# Altium schematic sheet P1.schdoc (part 1 of 3)
size 1187 x 840 mm; Symbol: Sheet-Symbol_A4; Company: EE_LAB; Version: V1.0; Page Size: A4; @Project Name: VIDEO_CONVERTER; @Page Count: 3; @Update Date: 2024-05-24; @Create Date: 2024-04-18; @Schematic Name: Schematic1; @Page No: 1; @Page Name: P1; Device: Sheet-Symbol_A4
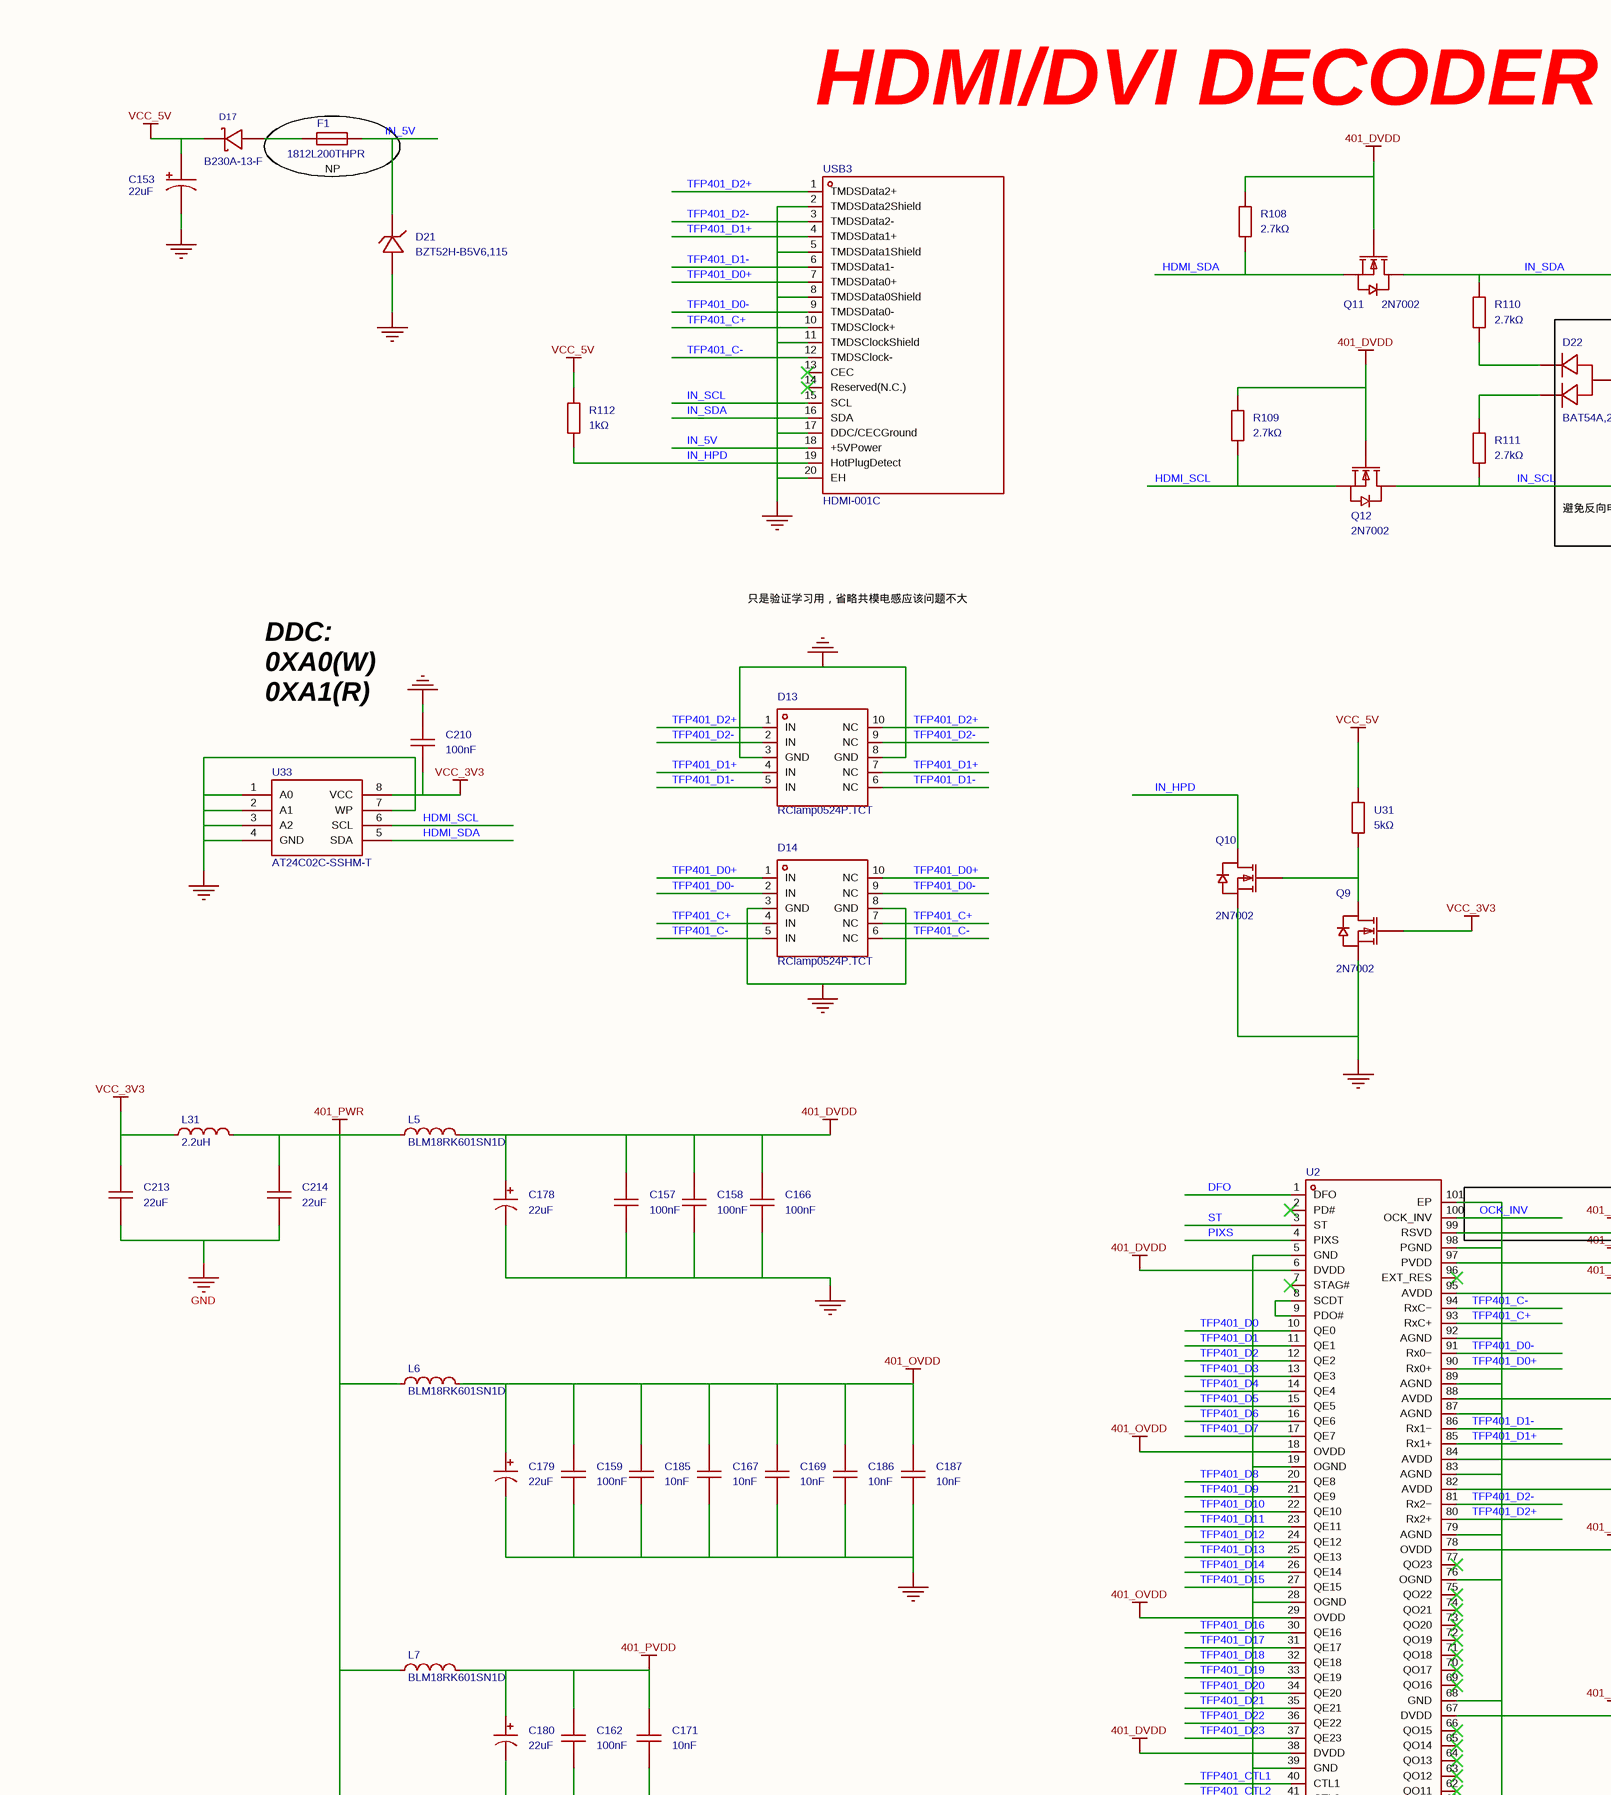
[diagram p0: P1.schdoc, top column 1 of 4]
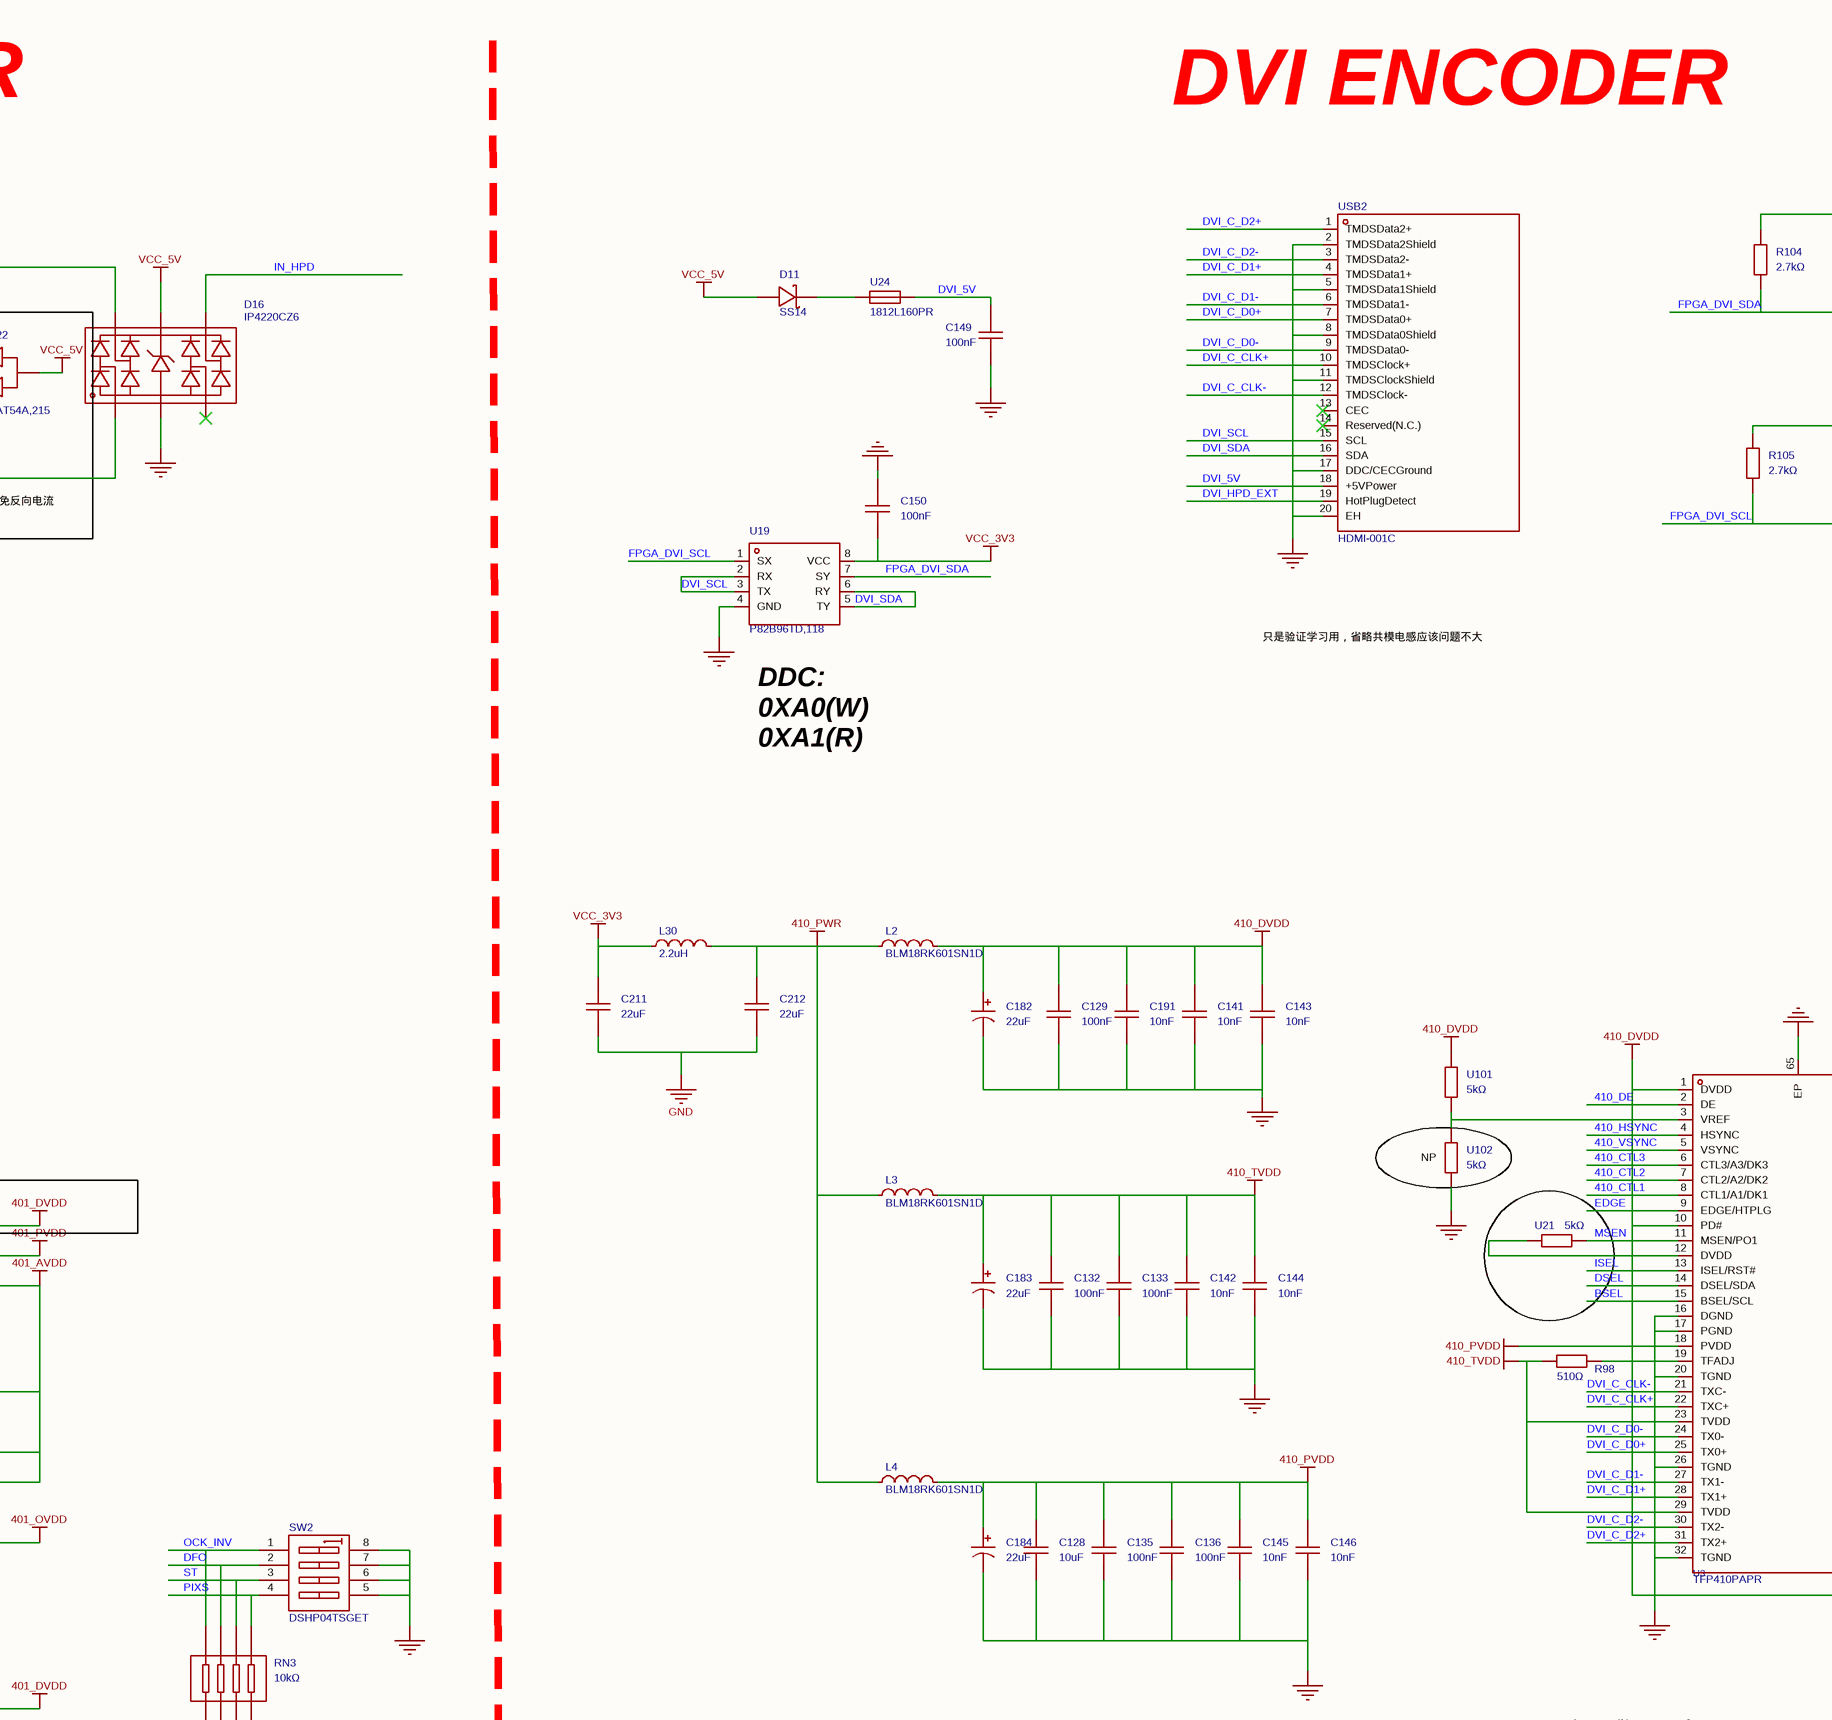
[diagram p1: P1.schdoc, top column 2 of 4]
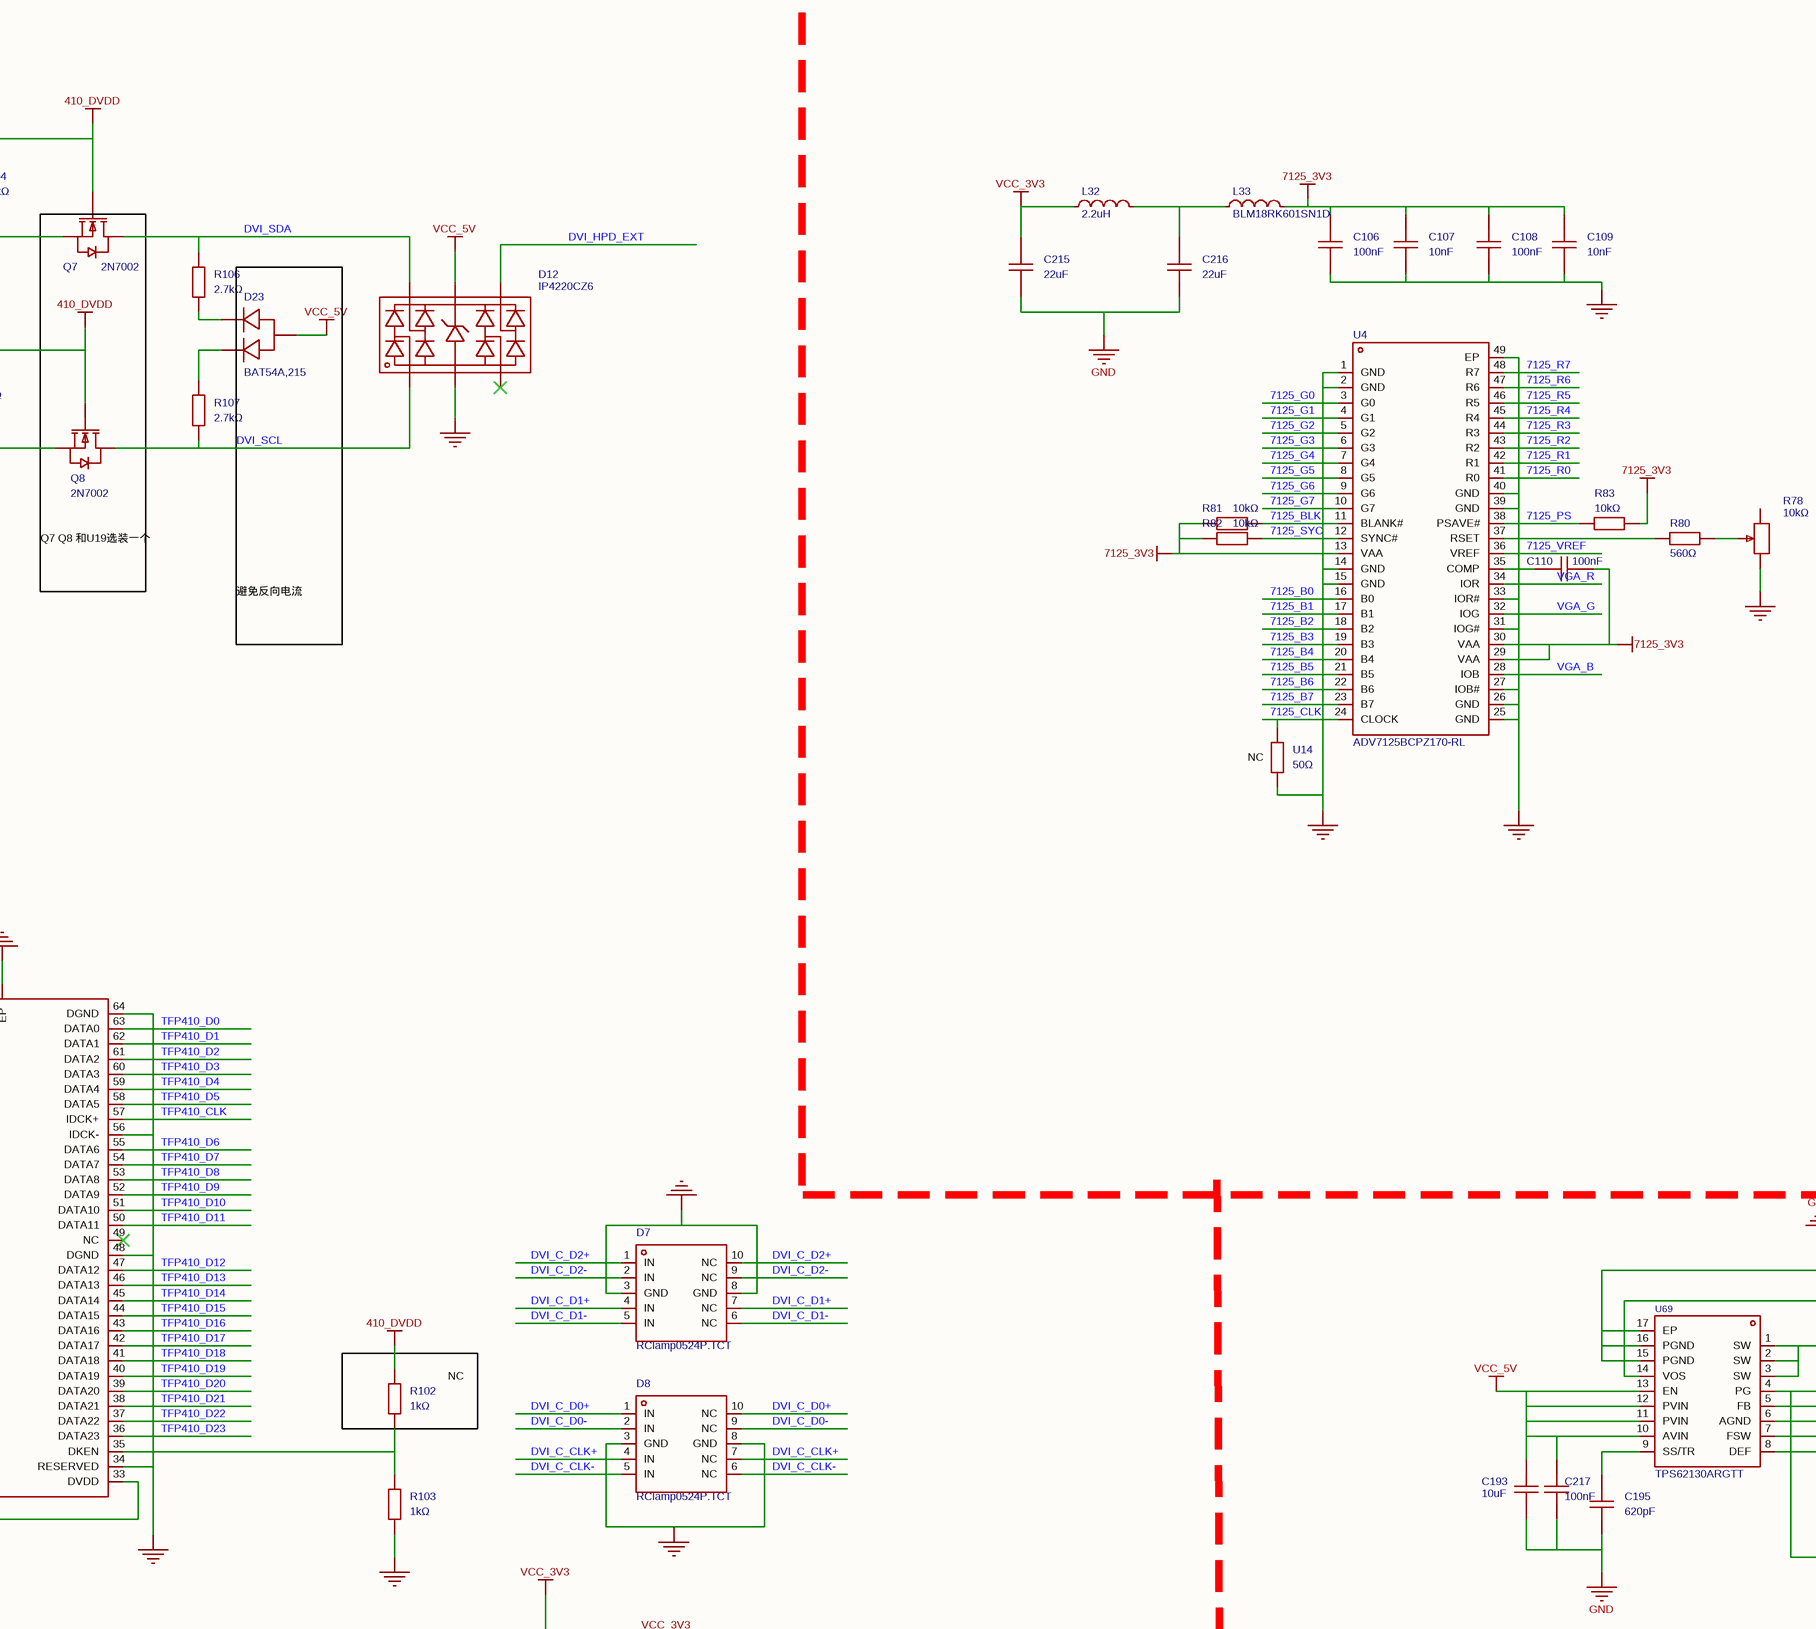
[diagram p2: P1.schdoc, top column 3 of 4]
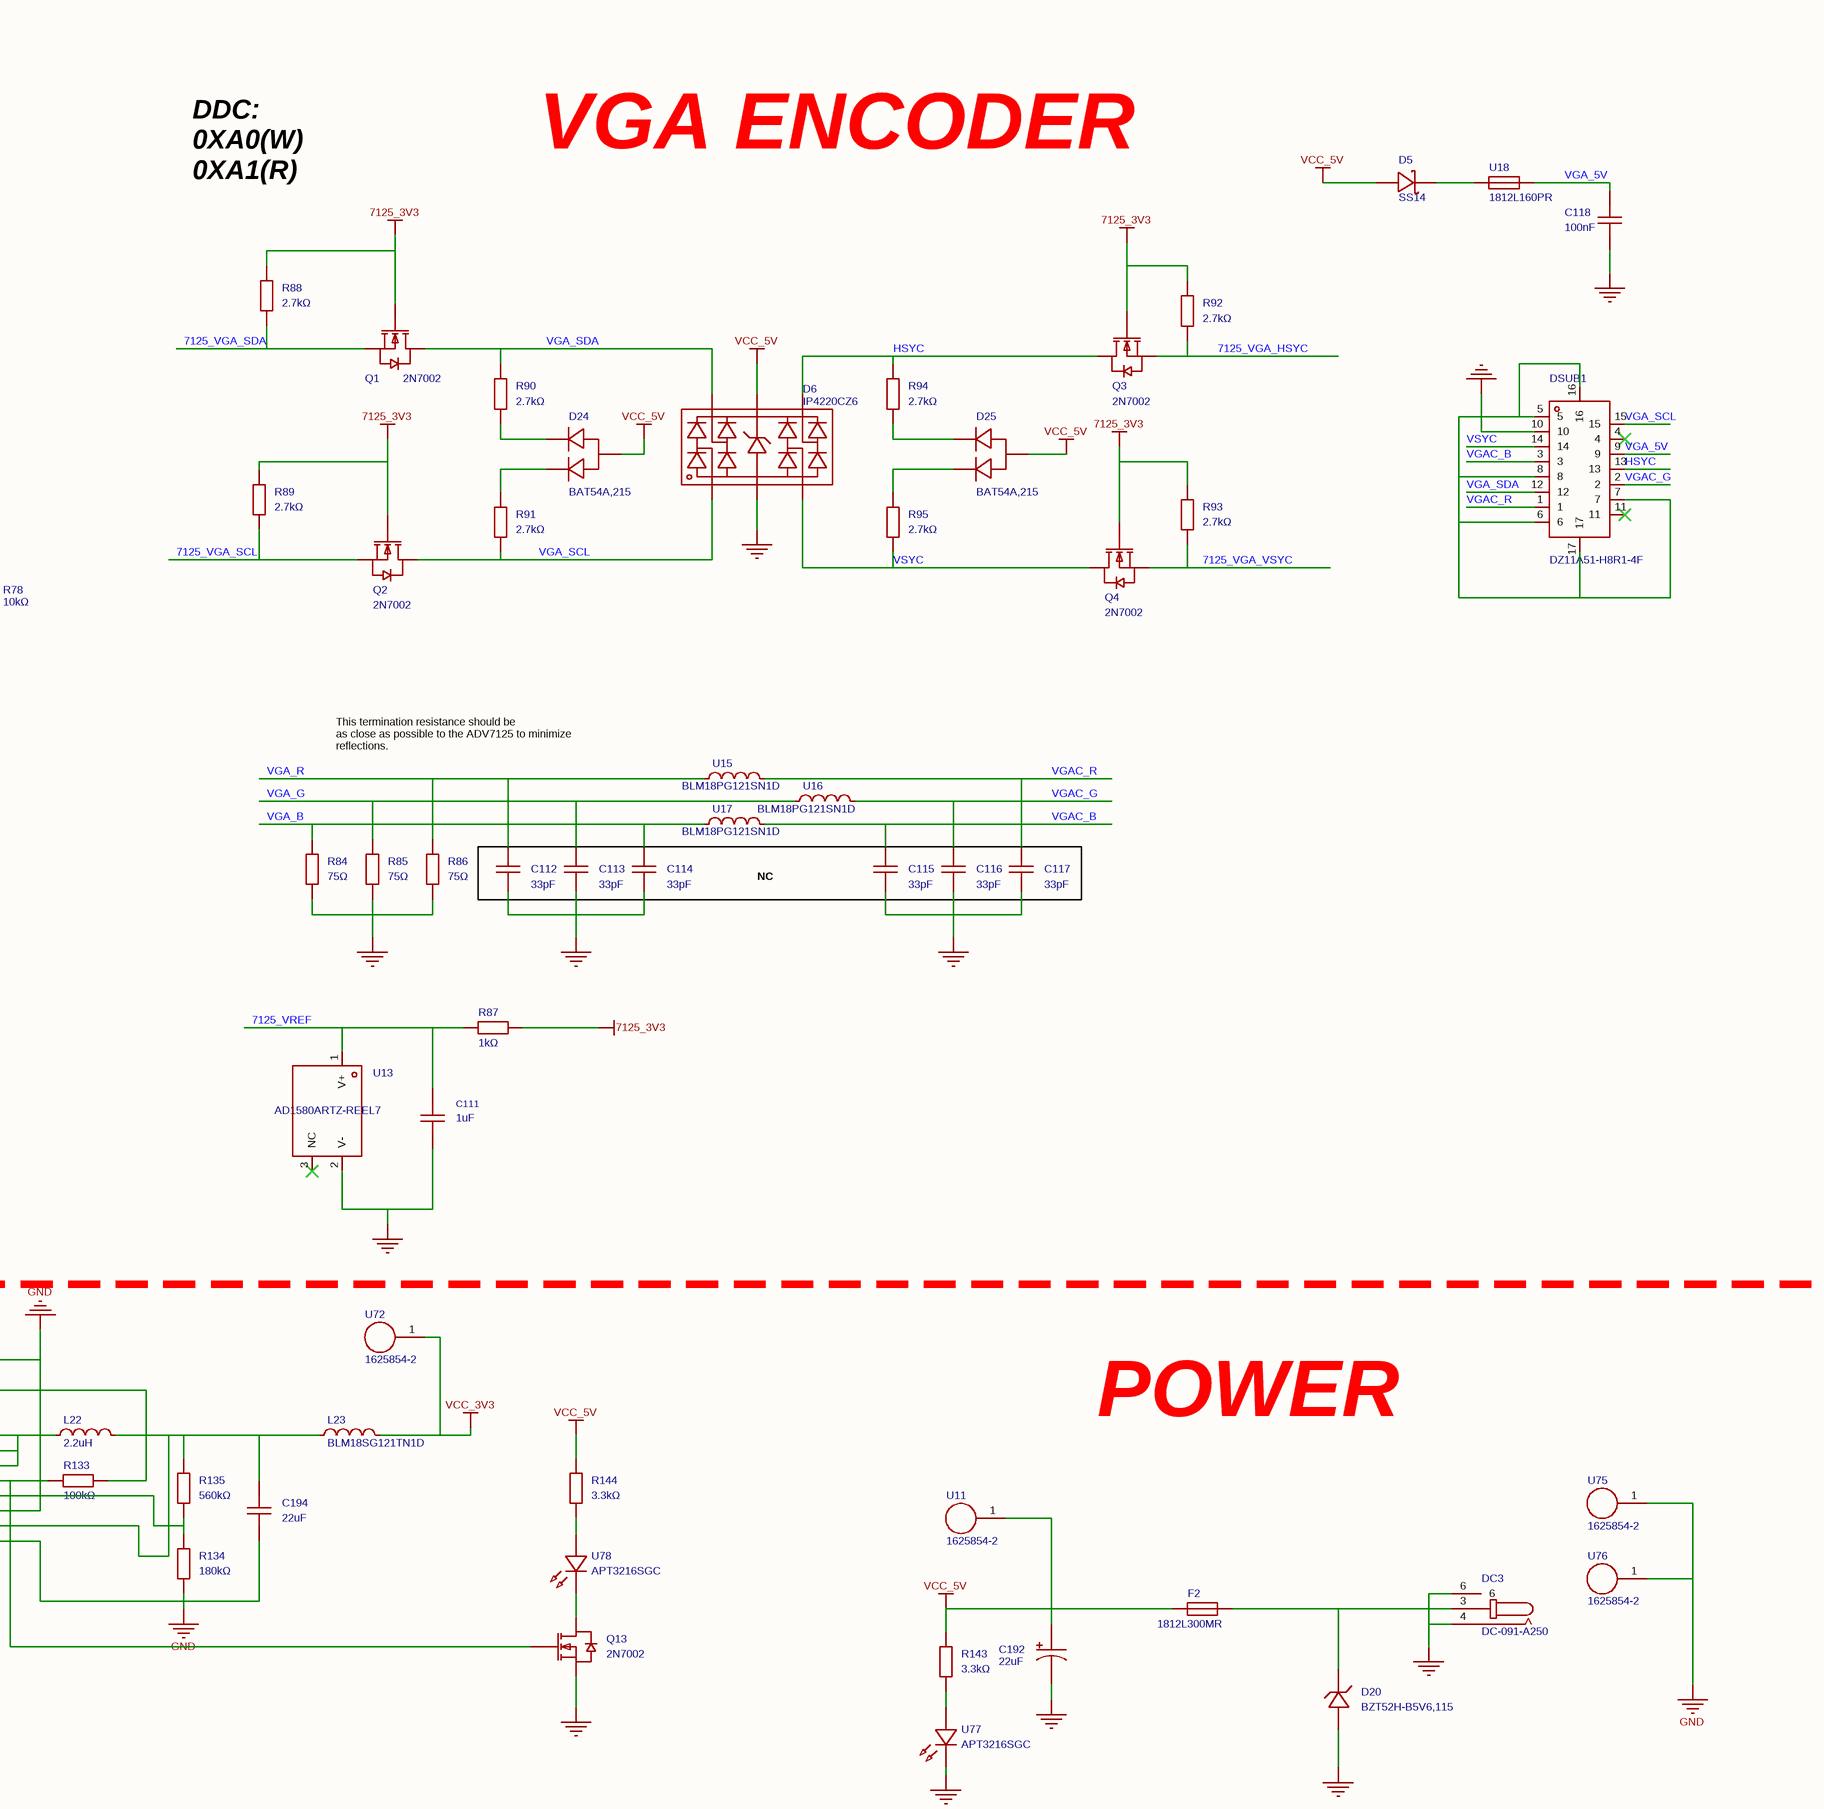
[diagram p3: P1.schdoc, top column 4 of 4]
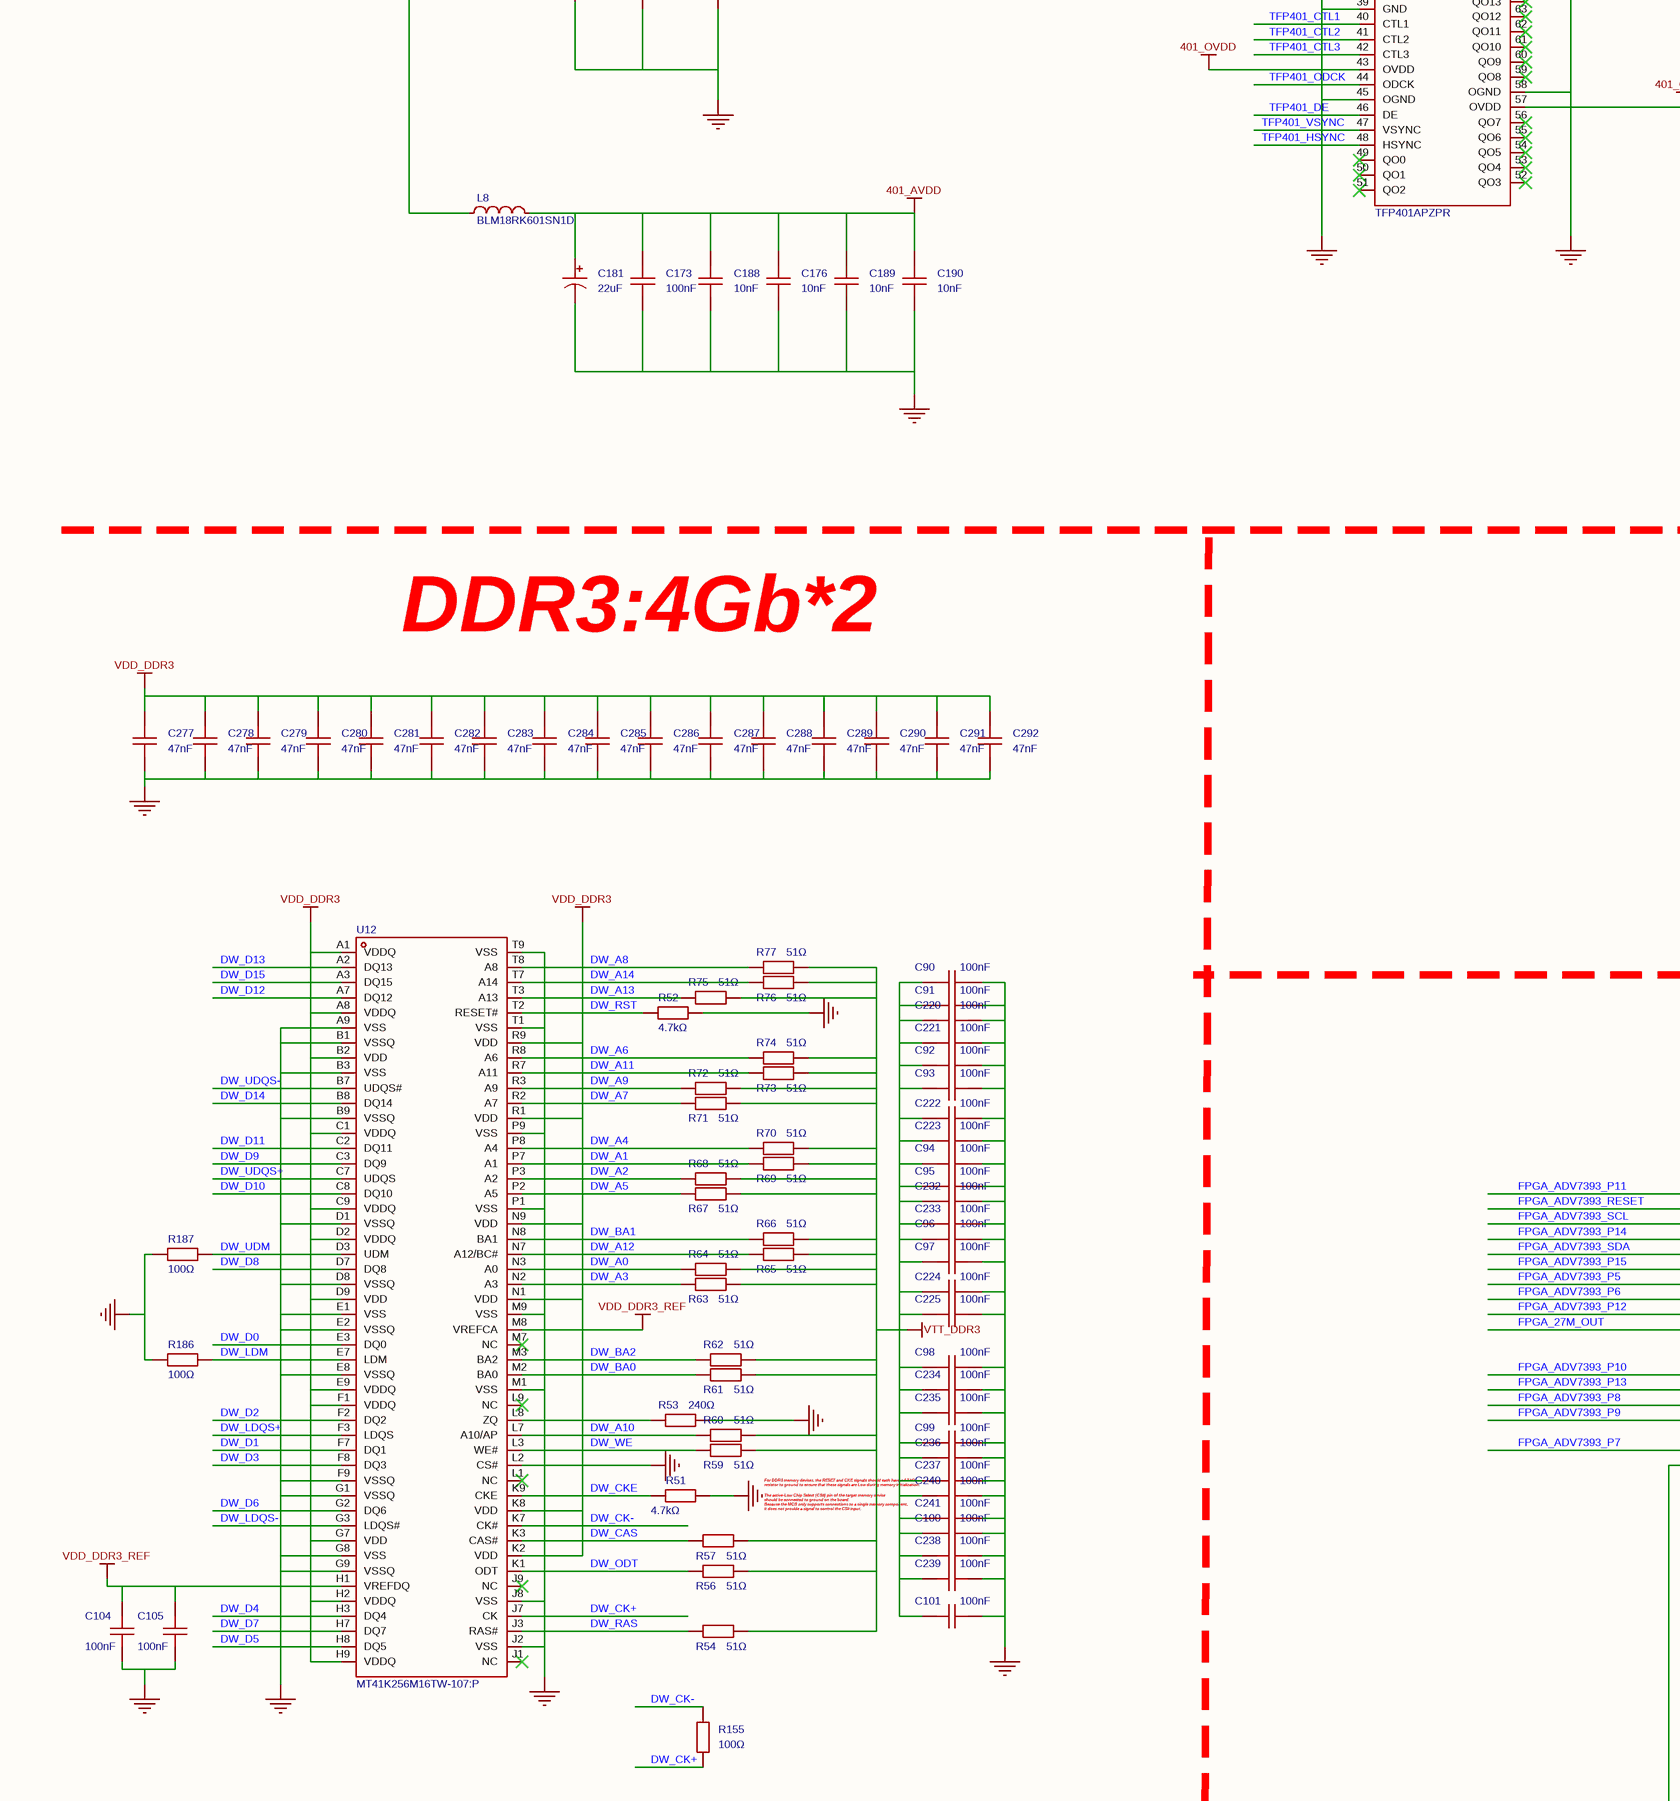
[diagram p4: P1.schdoc, centre column 1 of 4]
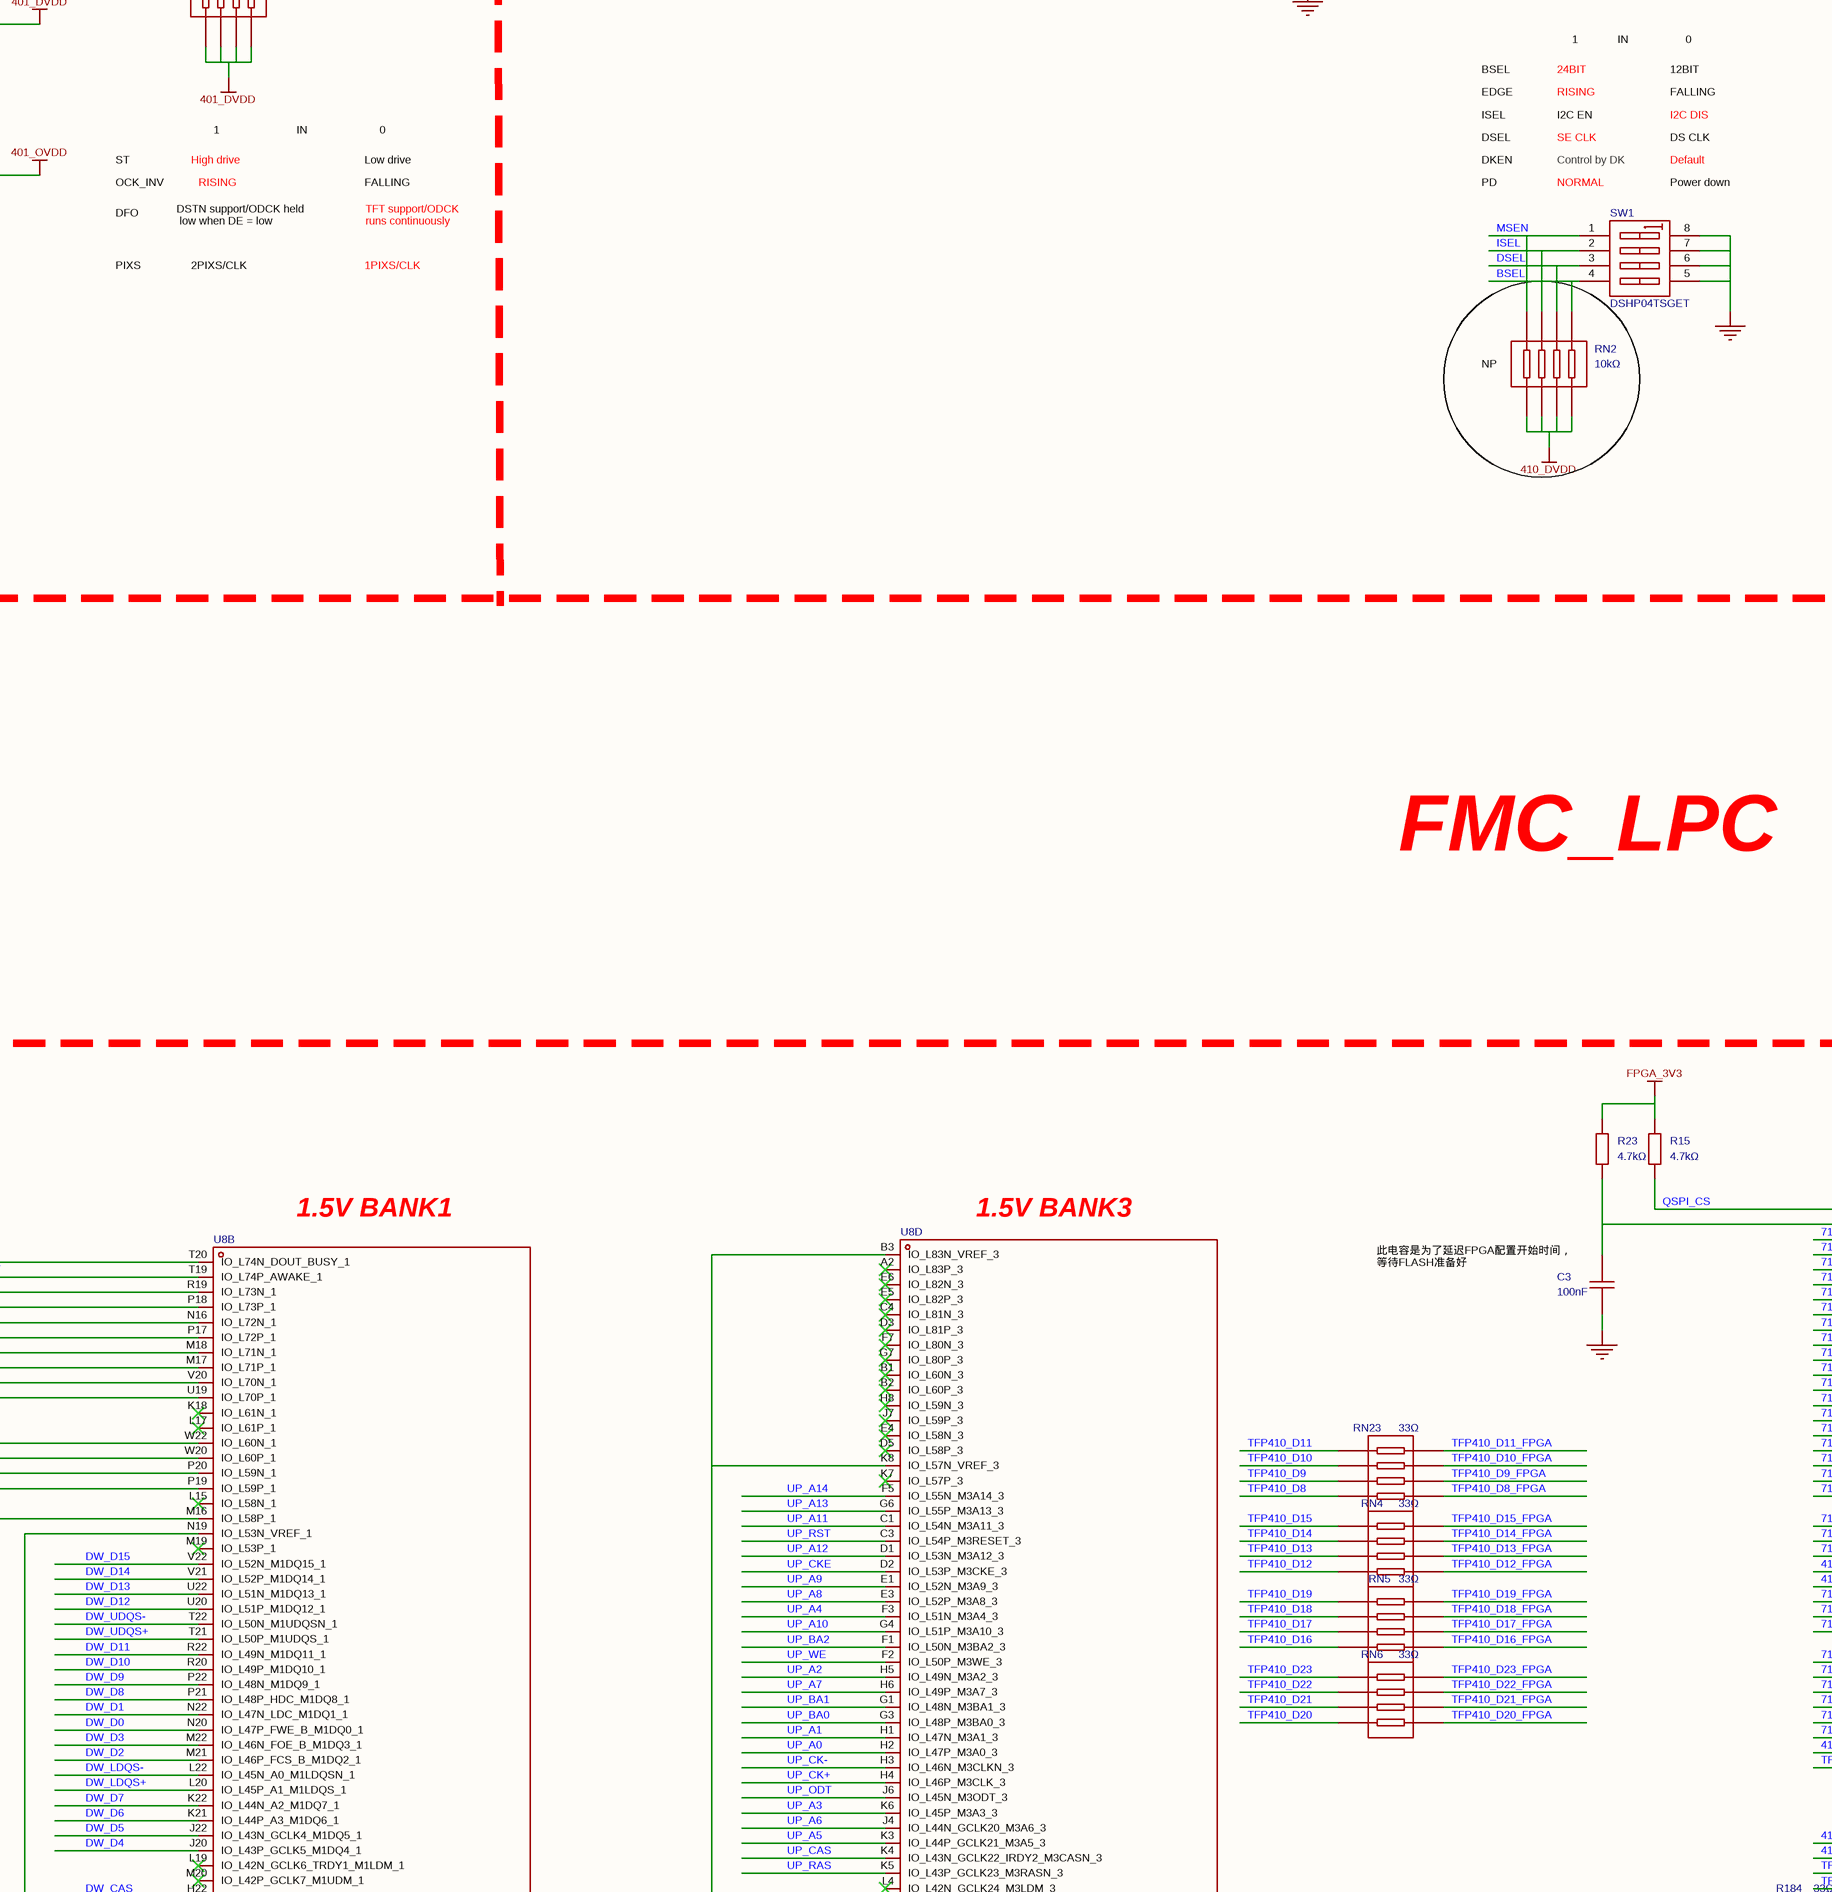
[diagram p5: P1.schdoc, centre column 2 of 4]
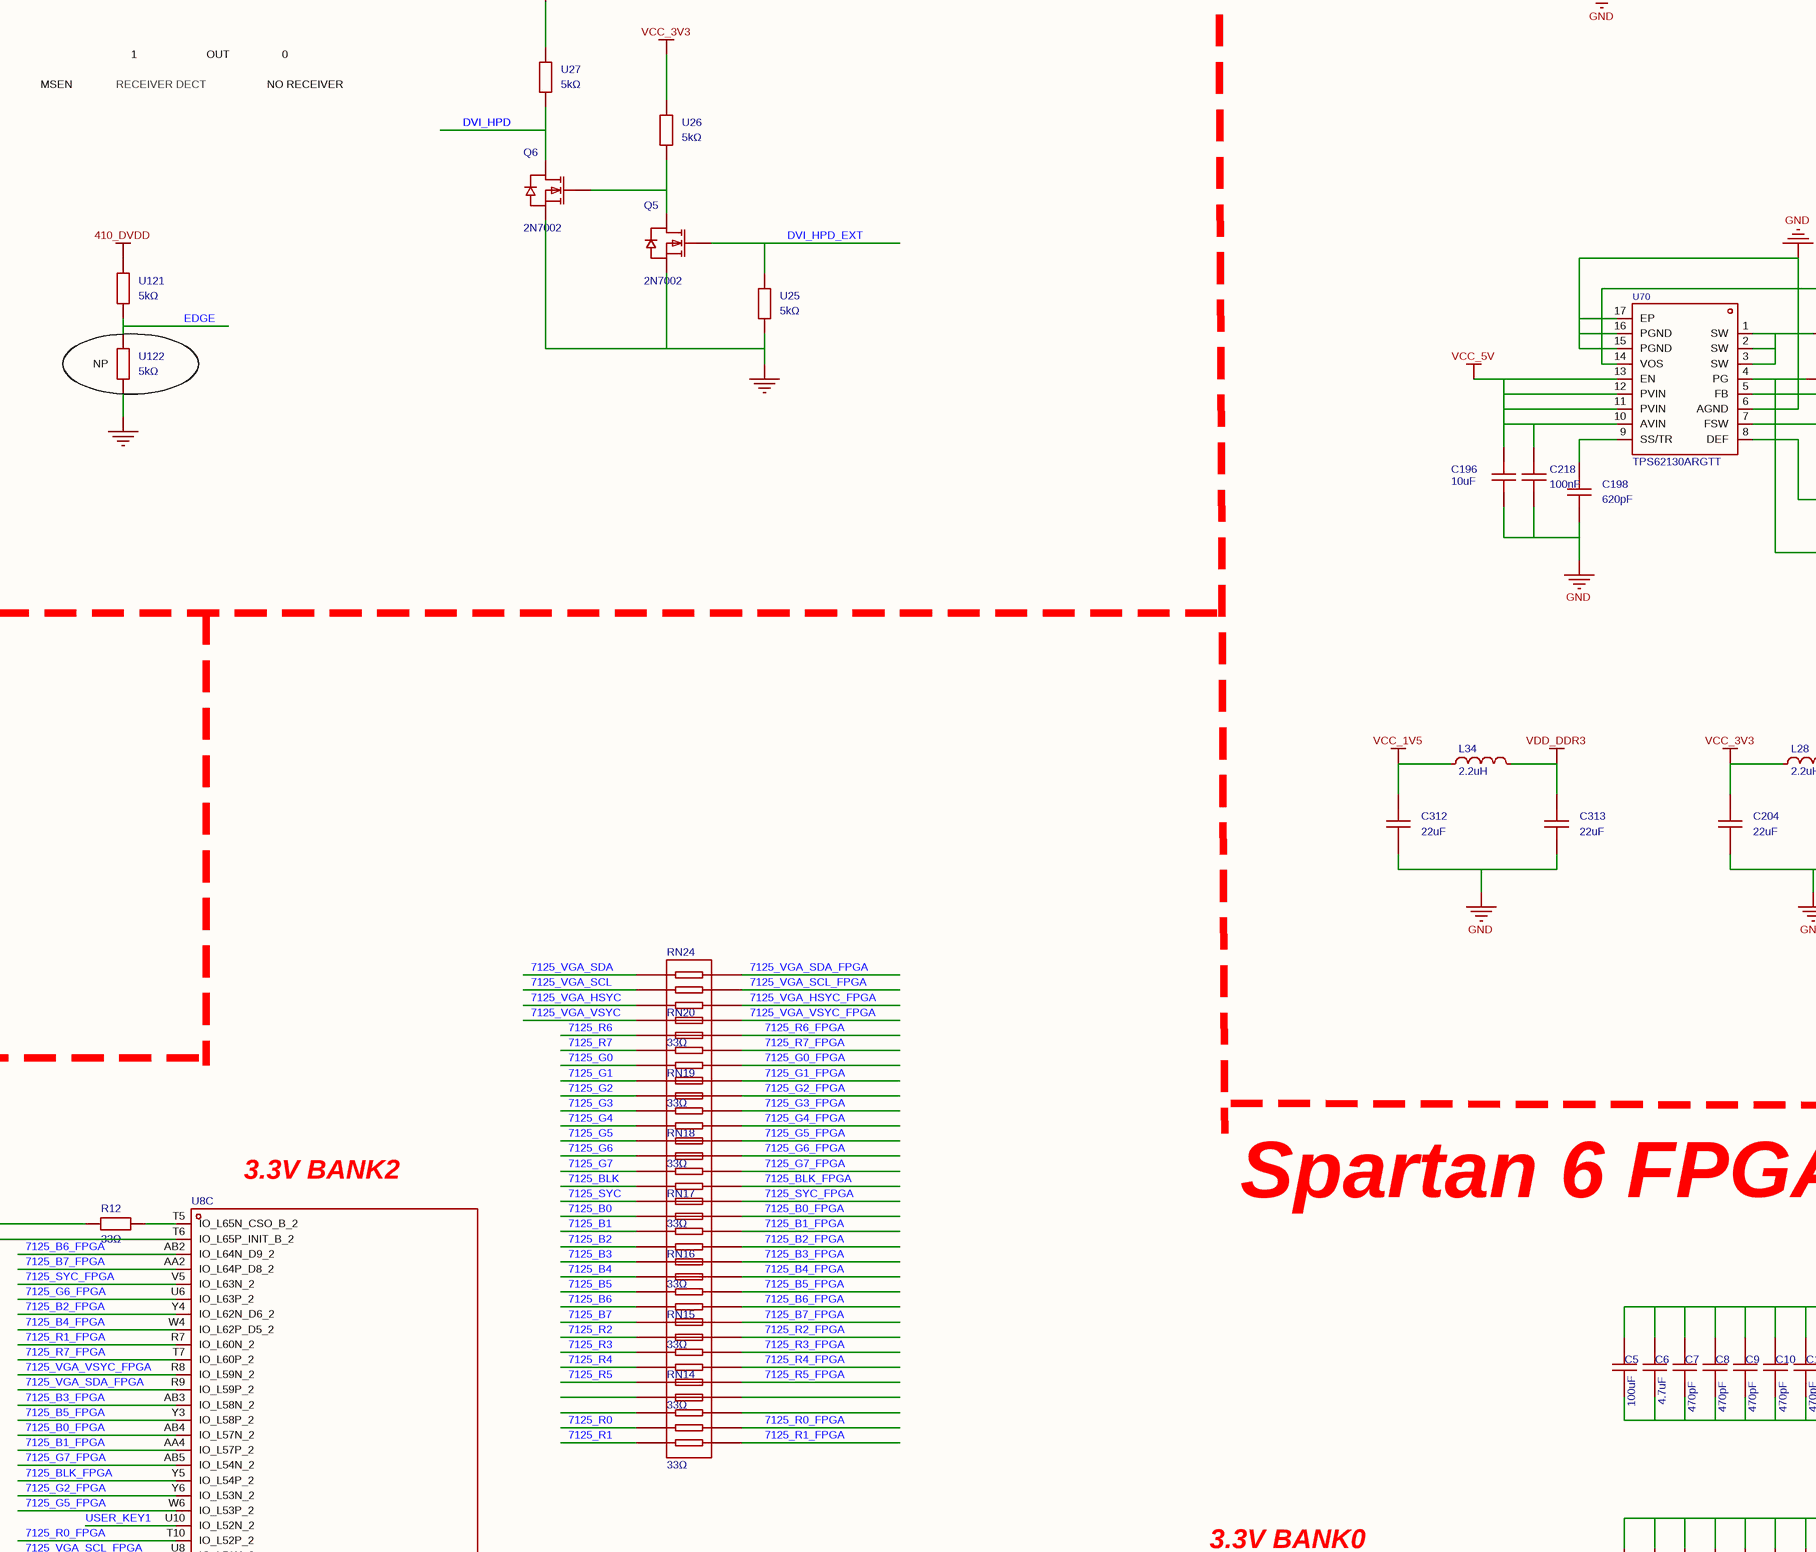
[diagram p6: P1.schdoc, centre column 3 of 4]
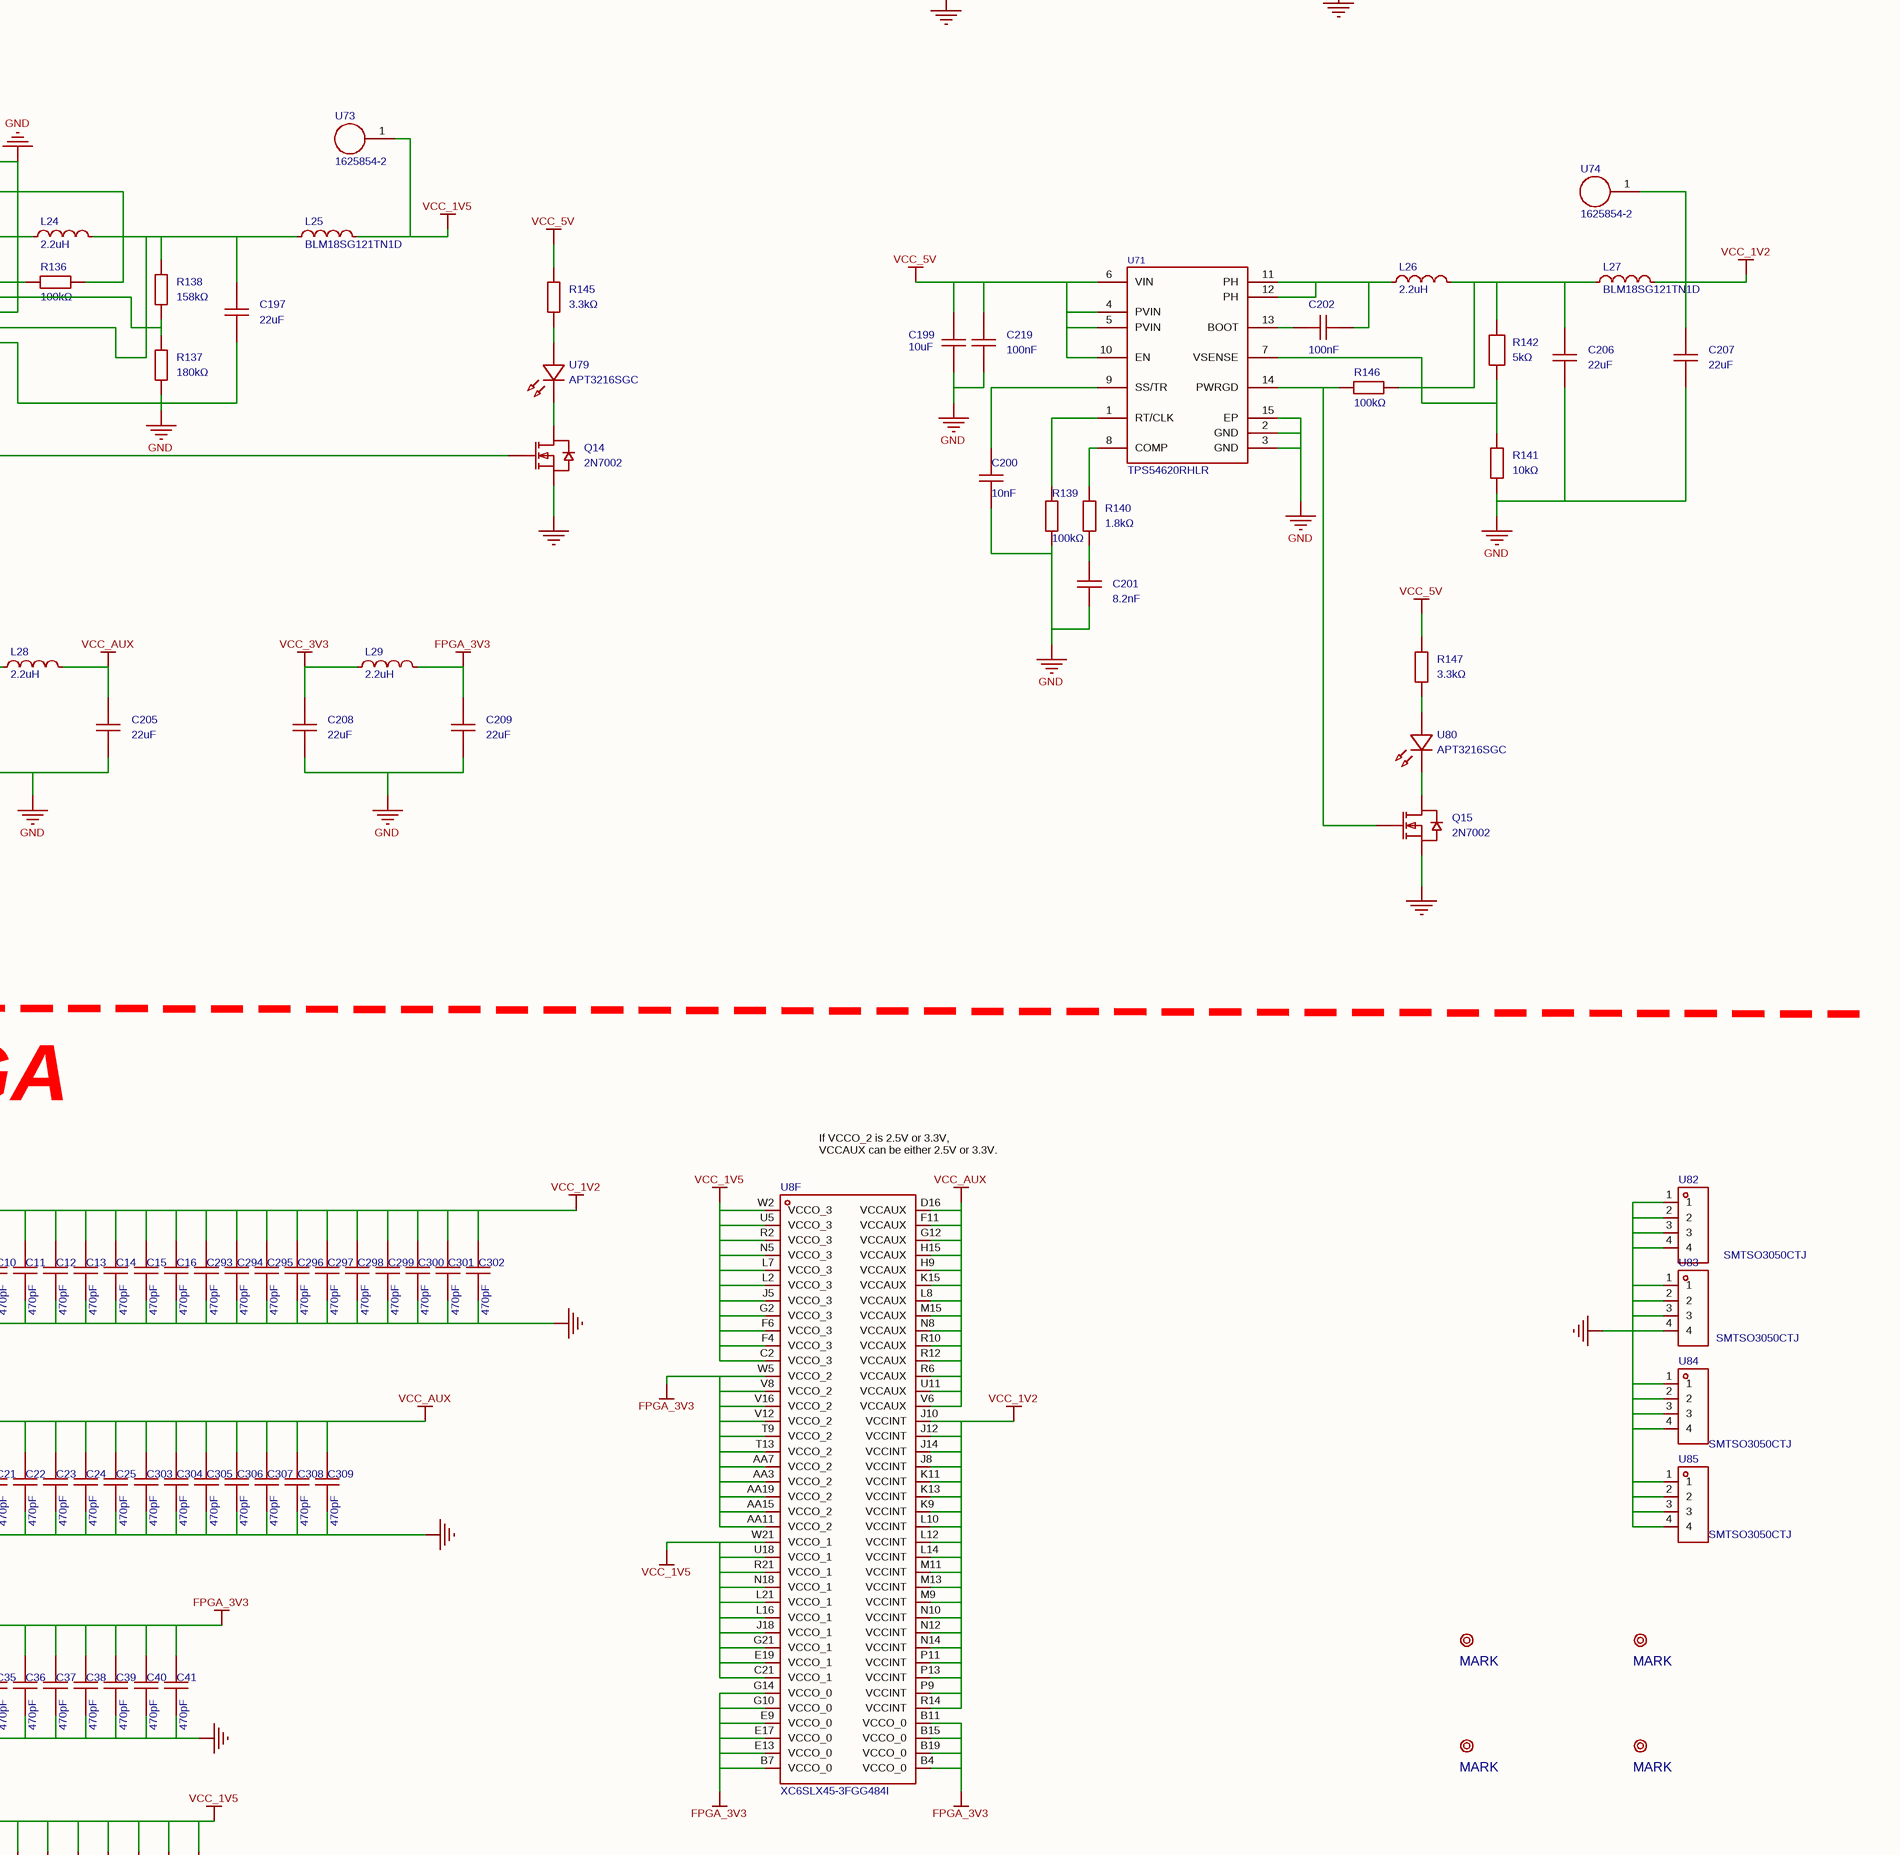
[diagram p7: P1.schdoc, centre column 4 of 4]
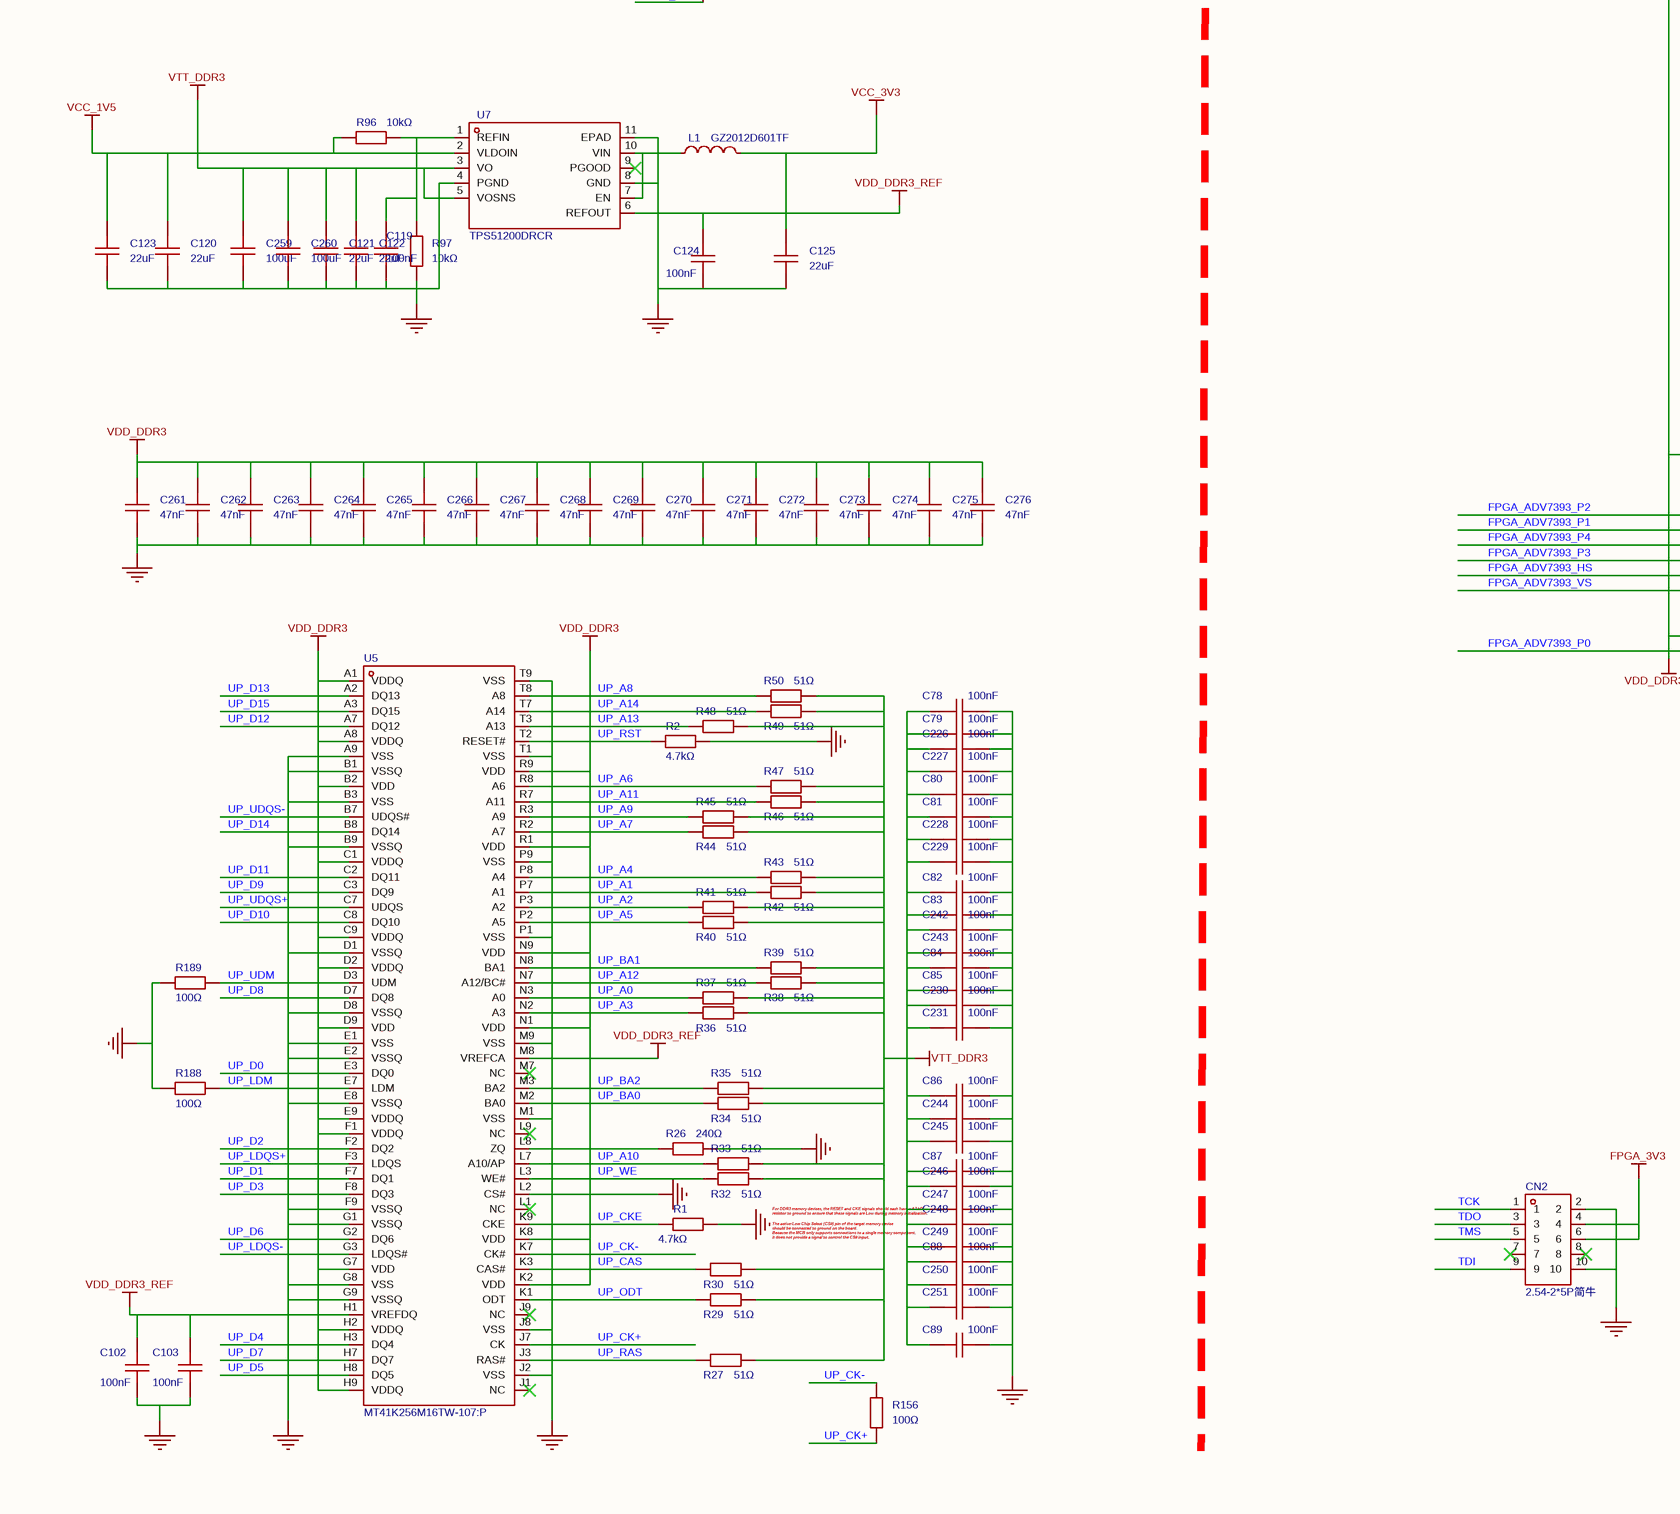
[diagram p8: P1.schdoc, bottom column 1 of 4]
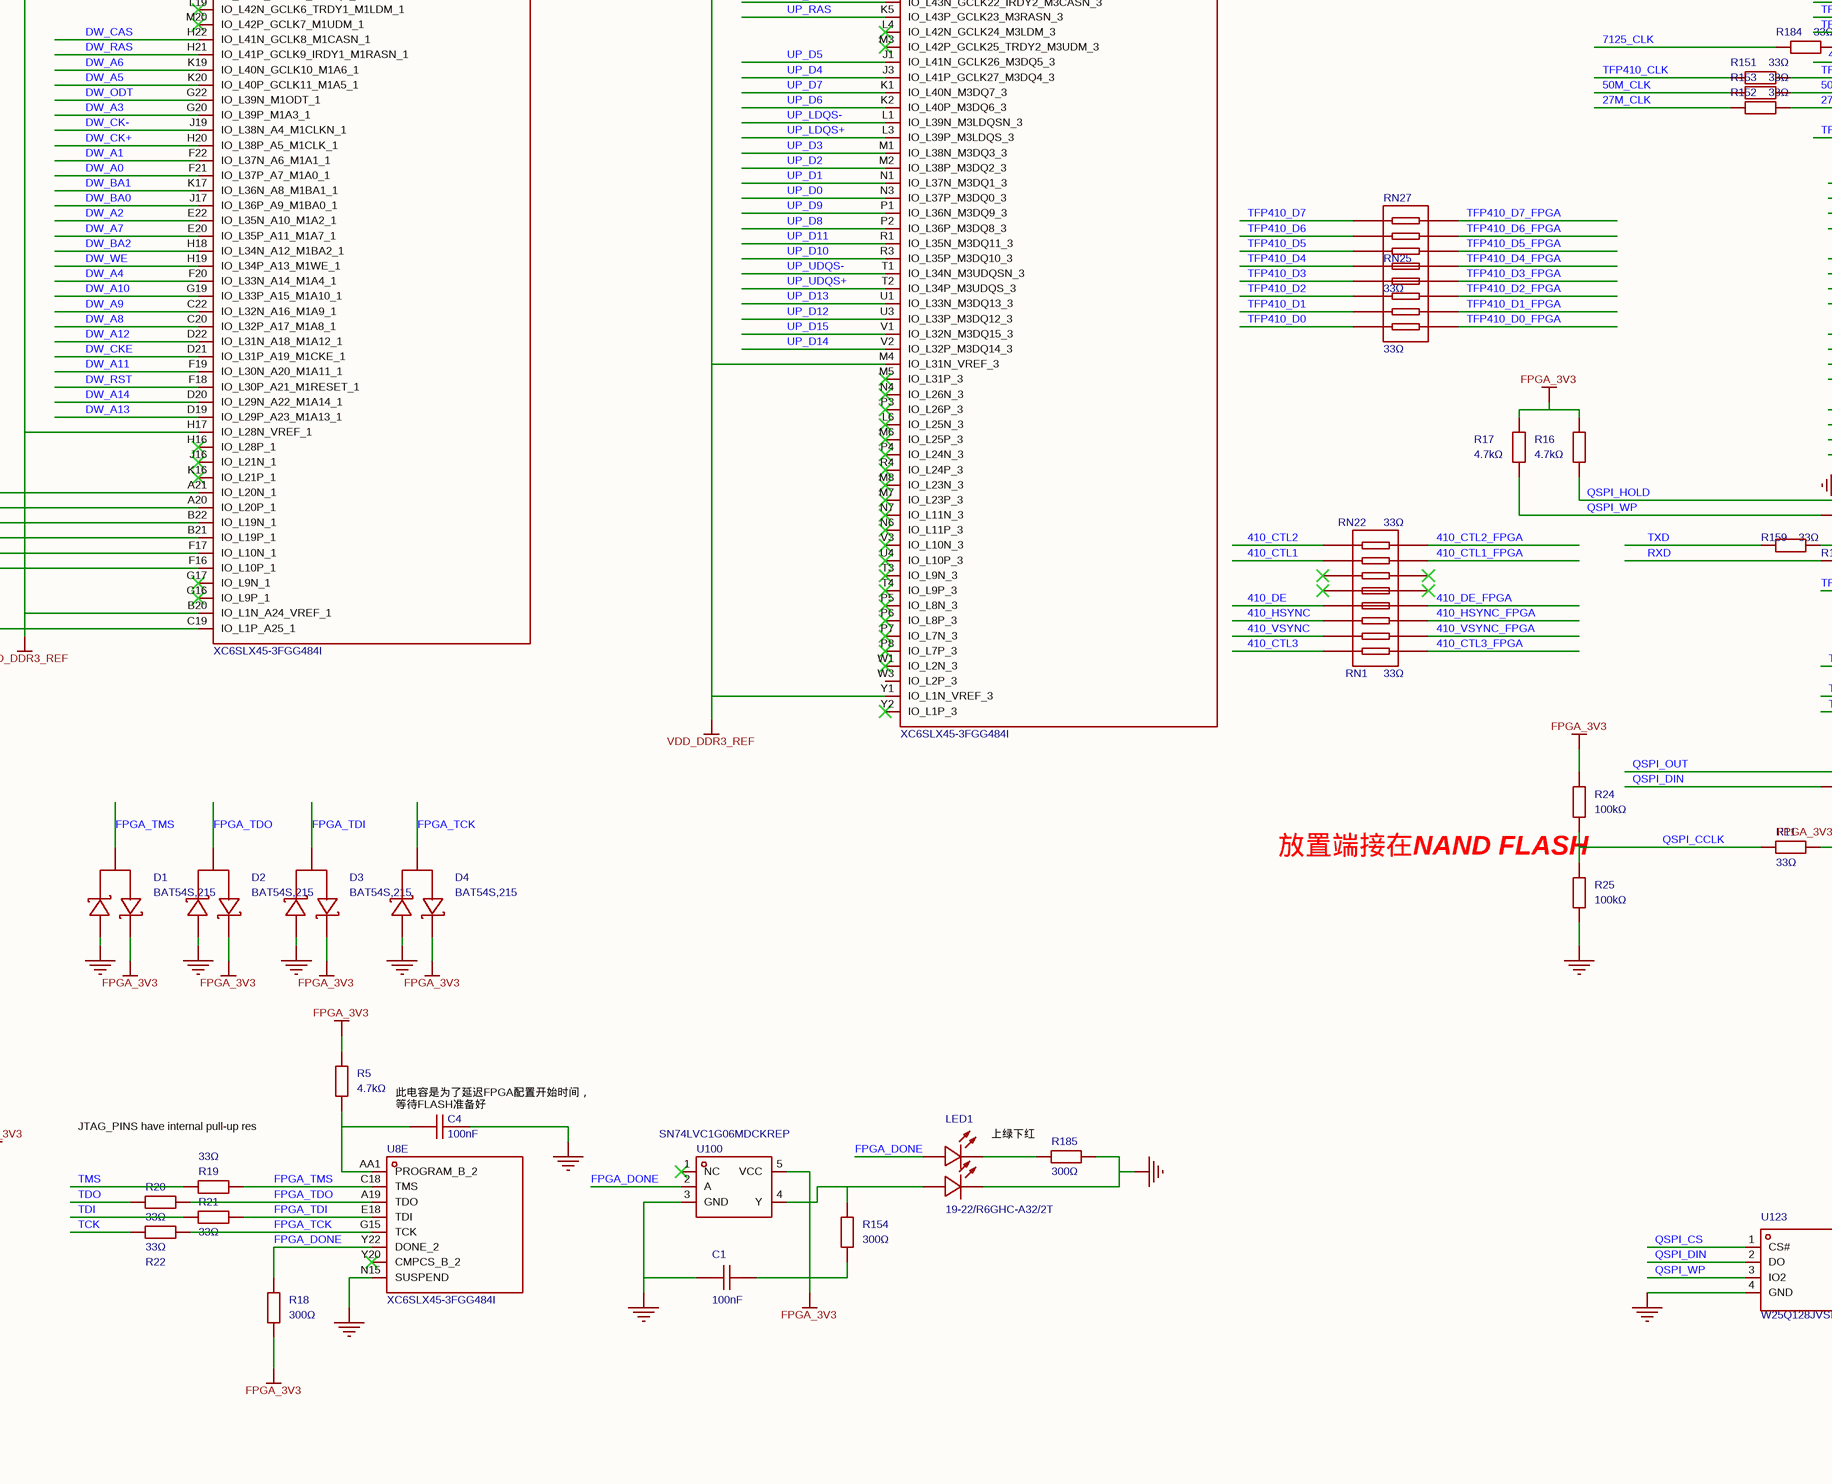
[diagram p9: P1.schdoc, bottom column 2 of 4]
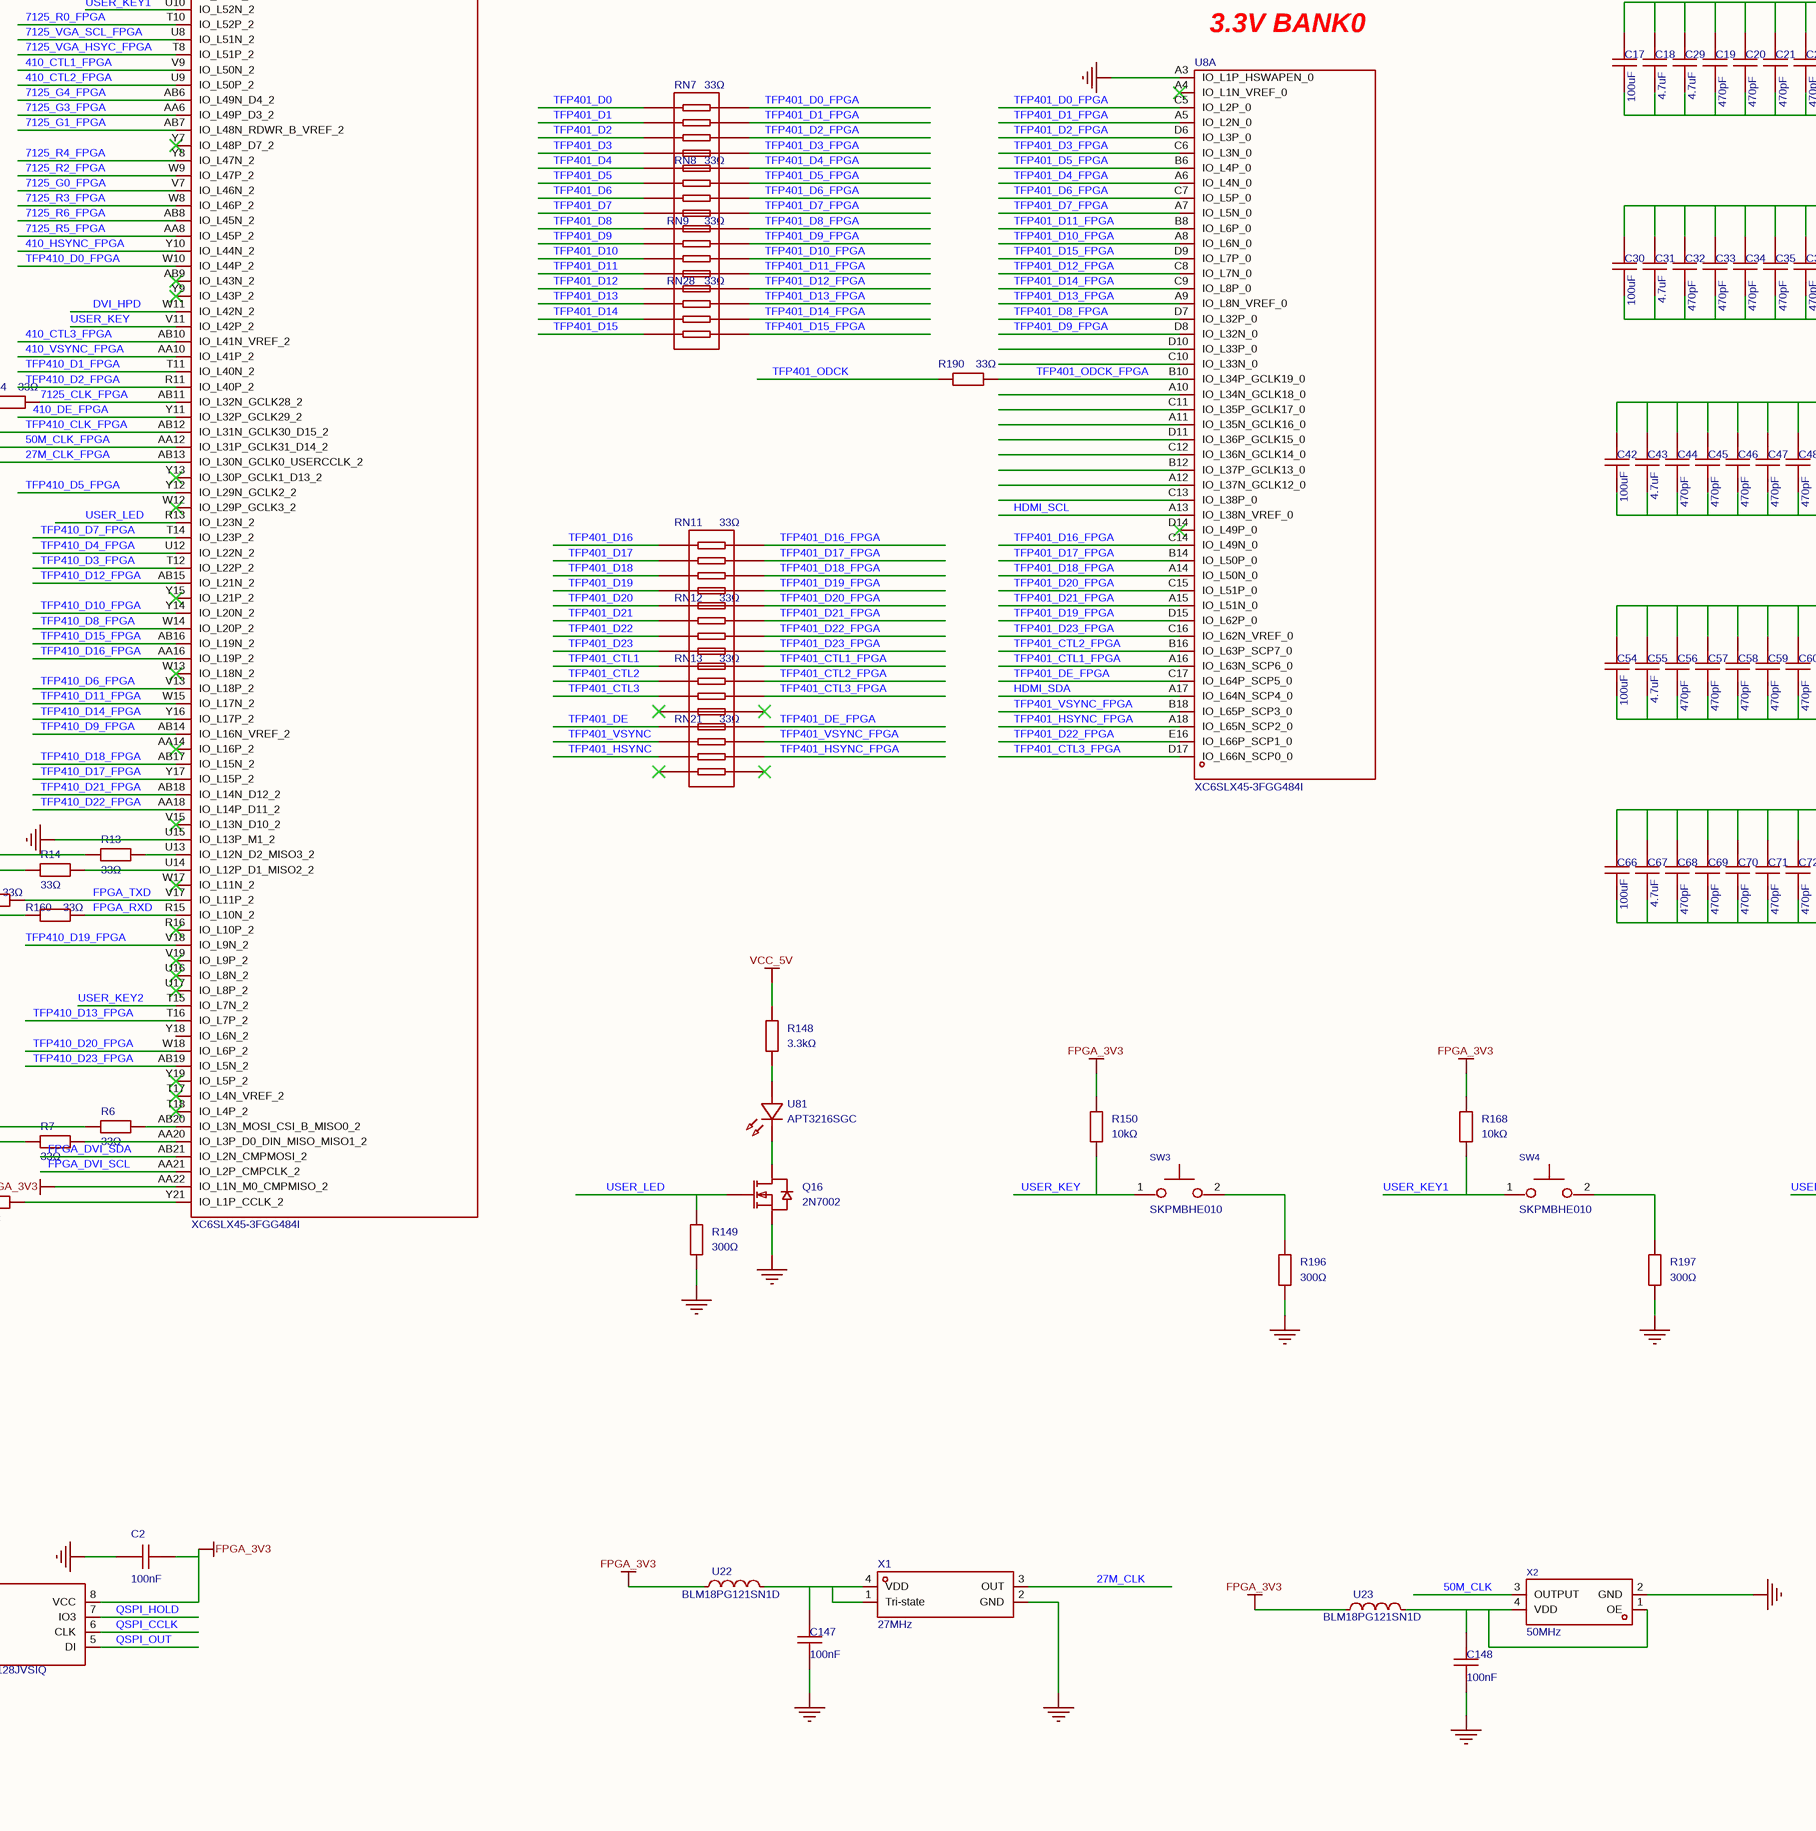
[diagram p10: P1.schdoc, bottom column 3 of 4]
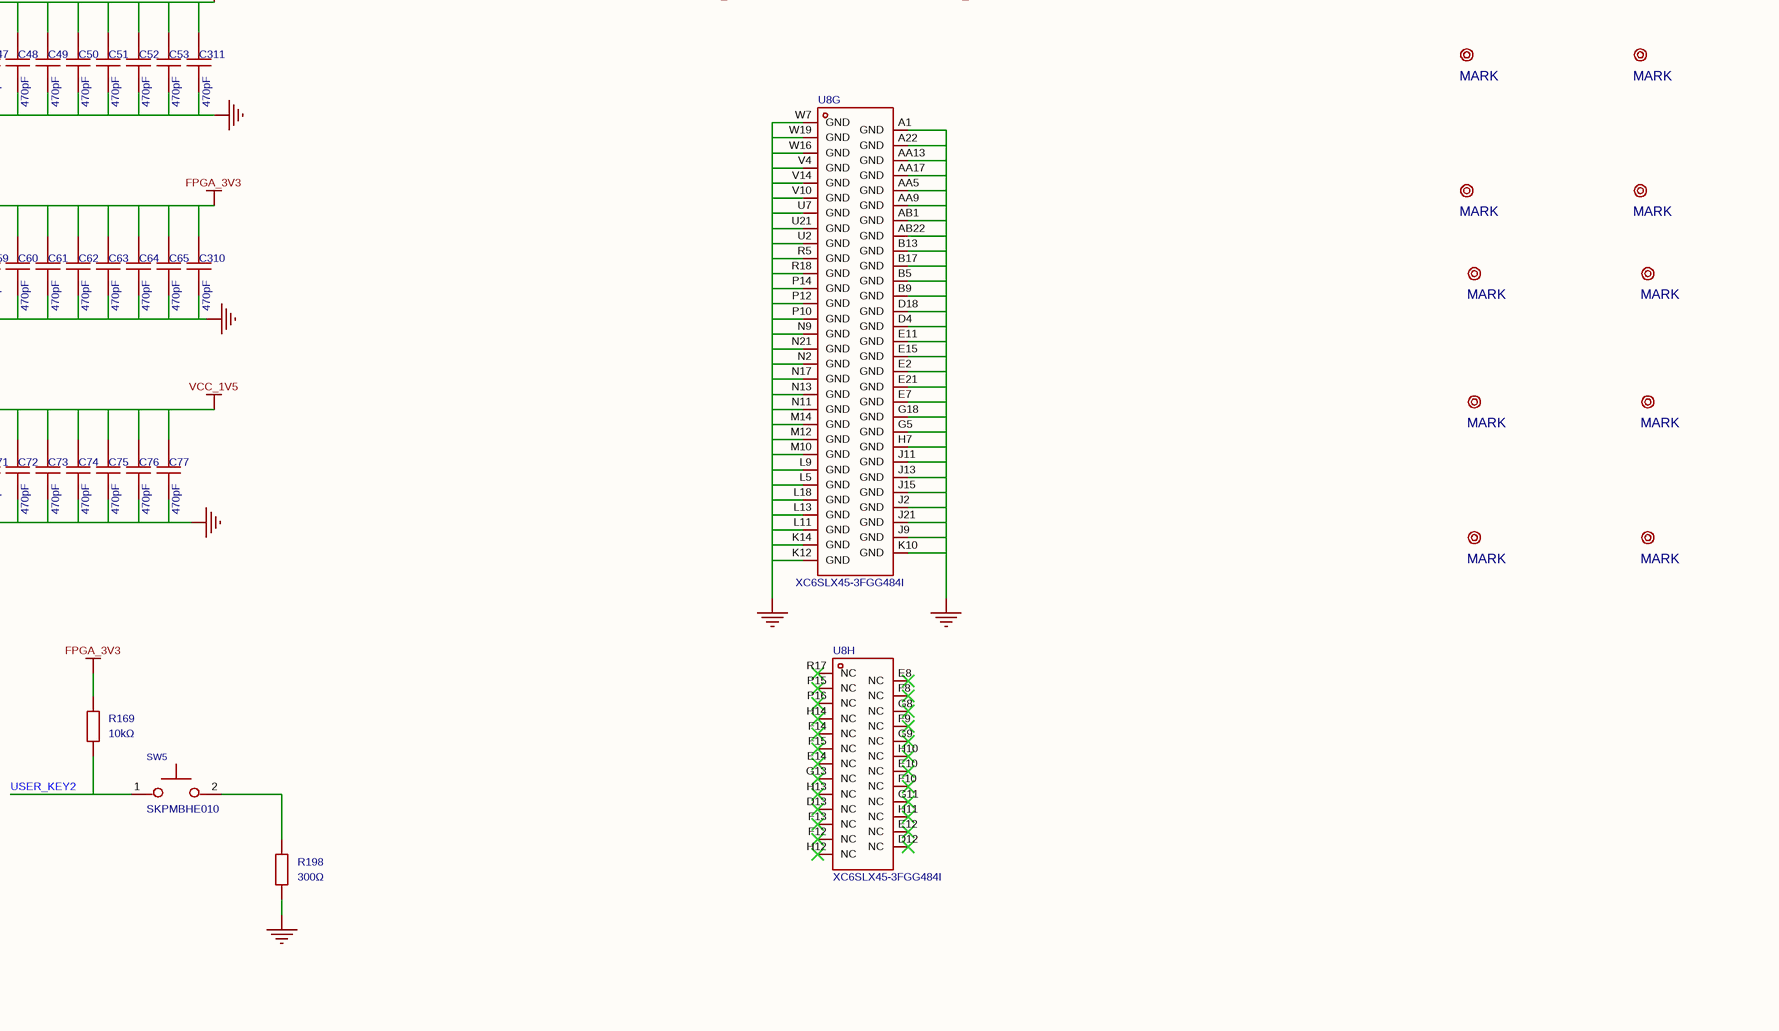
[diagram p11: P1.schdoc, bottom column 4 of 4]

## Parts
C1  100nF  [C0603]
C2  100nF  [C0603]
C3  100nF  [C0603]
C4  100nF  [C0603]
C5  100uF  [C1210]
C6  4.7uF  [C0603]
C7  470pF  [C0402]
C8  470pF  [C0402]
C9  470pF  [C0402]
C10  470pF  [C0402]
C11  470pF  [C0402]
C12  470pF  [C0402]
C13  470pF  [C0402]
C14  470pF  [C0402]
C15  470pF  [C0402]
C16  470pF  [C0402]
C17  100uF  [C1210]
C18  4.7uF  [C0603]
C19  470pF  [C0402]
C20  470pF  [C0402]
C21  470pF  [C0402]
C22  470pF  [C0402]
C23  470pF  [C0402]
C24  470pF  [C0402]
C25  470pF  [C0402]
C29  4.7uF  [C0603]
C30  100uF  [C1210]
C31  4.7uF  [C0603]
C32  470pF  [C0402]
C33  470pF  [C0402]
C34  470pF  [C0402]
C35  470pF  [C0402]
C36  470pF  [C0402]
C37  470pF  [C0402]
C38  470pF  [C0402]
C39  470pF  [C0402]
C40  470pF  [C0402]
C41  470pF  [C0402]
C42  100uF  [C1210]
C43  4.7uF  [C0603]
C44  470pF  [C0402]
C45  470pF  [C0402]
C46  470pF  [C0402]
C47  470pF  [C0402]
C48  470pF  [C0402]
C49  470pF  [C0402]
C50  470pF  [C0402]
C51  470pF  [C0402]
C52  470pF  [C0402]
C53  470pF  [C0402]
C54  100uF  [C1210]
C55  4.7uF  [C0603]
C56  470pF  [C0402]
C57  470pF  [C0402]
C58  470pF  [C0402]
C59  470pF  [C0402]
C60  470pF  [C0402]
C61  470pF  [C0402]
C62  470pF  [C0402]
C63  470pF  [C0402]
C64  470pF  [C0402]
C65  470pF  [C0402]
C66  100uF  [C1210]
C67  4.7uF  [C0603]
C68  470pF  [C0402]
C69  470pF  [C0402]
C70  470pF  [C0402]
C71  470pF  [C0402]
C72  470pF  [C0402]
C73  470pF  [C0402]
C74  470pF  [C0402]
C75  470pF  [C0402]
C76  470pF  [C0402]
C77  470pF  [C0402]
C78  100nF  [C0402]
C79  100nF  [C0402]
C80  100nF  [C0402]
C81  100nF  [C0402]
C82  100nF  [C0402]
C83  100nF  [C0402]
C84  100nF  [C0402]
C85  100nF  [C0402]
C86  100nF  [C0402]
C87  100nF  [C0402]
C88  100nF  [C0402]
C89  100nF  [C0402]
C90  100nF  [C0402]
C91  100nF  [C0402]
C92  100nF  [C0402]
C93  100nF  [C0402]
C94  100nF  [C0402]
C95  100nF  [C0402]
C96  100nF  [C0402]
C97  100nF  [C0402]
C98  100nF  [C0402]
C99  100nF  [C0402]
C100  100nF  [C0402]
C101  100nF  [C0402]
C102  100nF  [C0402]
C103  100nF  [C0402]
C104  100nF  [C0402]
C105  100nF  [C0402]
C106  100nF  [C0402]
C107  10nF  [C0402]
C108  100nF  [C0402]
C109  10nF  [C0402]
C110  100nF  [C0402]
C111  1uF  [C0402]
C112  33pF  [C0402]
C113  33pF  [C0402]
C114  33pF  [C0402]
C115  33pF  [C0402]
C116  33pF  [C0402]
C117  33pF  [C0402]
C118  100nF  [C0603]
C119  100nF  [C0402]
C120  22uF  [C0402]
C121  22uF  [C0402]
C122  22uF  [C0402]
C123  22uF  [C0402]
C124  100nF  [C0402]
C125  22uF  [C0402]
C128  10uF  [C0805]
C129  100nF  [C0402]
C132  100nF  [C0402]
C133  100nF  [C0402]
C135  100nF  [C0402]
C136  100nF  [C0402]
C141  10nF  [C0402]
C142  10nF  [C0402]
C143  10nF  [C0402]
C144  10nF  [C0402]
C145  10nF  [C0402]
C146  10nF  [C0402]
C147  100nF  [C0603]
C148  100nF  [C0603]
C149  100nF  [C0603]
C150  100nF  [C0402]
C153  22uF  [CAP-SMD_BD5.0-L5.3-W5.3-FD]
C157  100nF  [C0402]
C158  100nF  [C0402]
C159  100nF  [C0402]
C162  100nF  [C0402]
C166  100nF  [C0402]
C167  10nF  [C0402]
C169  10nF  [C0402]
C171  10nF  [C0402]
C173  100nF  [C0402]
C176  10nF  [C0402]
C178  22uF  [CAP-SMD_L3.5-W2.8-R-RD]
C179  22uF  [CAP-SMD_L3.5-W2.8-R-RD]
C180  22uF  [CAP-SMD_L3.5-W2.8-R-RD]
C181  22uF  [CAP-SMD_L3.5-W2.8-R-RD]
C182  22uF  [CAP-SMD_L3.5-W2.8-R-RD]
C183  22uF  [CAP-SMD_L3.5-W2.8-R-RD]
C184  22uF  [CAP-SMD_L3.5-W2.8-R-RD]
C185  10nF  [C0402]
C186  10nF  [C0402]
C187  10nF  [C0402]
C188  10nF  [C0402]
C189  10nF  [C0402]
C190  10nF  [C0402]
C191  10nF  [C0402]
C192  22uF  [CAP-SMD_BD5.0-L5.3-W5.3-FD]
C193  10uF  [C0805]
C194  22uF  [C0805]
C195  620pF  [C0603]
C196  10uF  [C0805]
C197  22uF  [C0805]
C198  620pF  [C0603]
C199  10uF  [C0805]
C200  10nF  [C0402]
C201  8.2nF  [C0402]
C202  100nF  [C0603]
C204  22uF  [C1210]
C205  22uF  [C1210]
C206  22uF  [C1210]
C207  22uF  [C1210]
C208  22uF  [C1210]
C209  22uF  [C1210]
C210  100nF  [C0402]
C211  22uF  [C1210]
C212  22uF  [C1210]
C213  22uF  [C1210]
C214  22uF  [C1210]
C215  22uF  [C1210]
C216  22uF  [C1210]
C217  100nF  [C0402]
C218  100nF  [C0402]
C219  100nF  [C0402]
C220  100nF  [C0402]
C221  100nF  [C0402]
C222  100nF  [C0402]
C223  100nF  [C0402]
C224  100nF  [C0402]
C225  100nF  [C0402]
C226  100nF  [C0402]
C227  100nF  [C0402]
C228  100nF  [C0402]
C229  100nF  [C0402]
C230  100nF  [C0402]
C231  100nF  [C0402]
C232  100nF  [C0402]
C233  100nF  [C0402]
C234  100nF  [C0402]
C235  100nF  [C0402]
C236  100nF  [C0402]
C237  100nF  [C0402]
C238  100nF  [C0402]
C239  100nF  [C0402]
C240  100nF  [C0402]
C241  100nF  [C0402]
C242  100nF  [C0402]
C243  100nF  [C0402]
C244  100nF  [C0402]
C245  100nF  [C0402]
C246  100nF  [C0402]
C247  100nF  [C0402]
C248  100nF  [C0402]
C249  100nF  [C0402]
C250  100nF  [C0402]
C251  100nF  [C0402]
C259  100uF  [C1206]
C260  100uF  [C1206]
C261  47nF  [C0402]
C262  47nF  [C0402]
C263  47nF  [C0402]
C264  47nF  [C0402]
C265  47nF  [C0402]
C266  47nF  [C0402]
C267  47nF  [C0402]
C268  47nF  [C0402]
C269  47nF  [C0402]
C270  47nF  [C0402]
C271  47nF  [C0402]
C272  47nF  [C0402]
C273  47nF  [C0402]
C274  47nF  [C0402]
C275  47nF  [C0402]
C276  47nF  [C0402]
C277  47nF  [C0402]
C278  47nF  [C0402]
C279  47nF  [C0402]
C280  47nF  [C0402]
C281  47nF  [C0402]
C282  47nF  [C0402]
C283  47nF  [C0402]
C284  47nF  [C0402]
C285  47nF  [C0402]
C286  47nF  [C0402]
C287  47nF  [C0402]
C288  47nF  [C0402]
C289  47nF  [C0402]
C290  47nF  [C0402]
C291  47nF  [C0402]
C292  47nF  [C0402]
C293  470pF  [C0402]
C294  470pF  [C0402]
C295  470pF  [C0402]
C296  470pF  [C0402]
C297  470pF  [C0402]
C298  470pF  [C0402]
C299  470pF  [C0402]
C300  470pF  [C0402]
C301  470pF  [C0402]
C302  470pF  [C0402]
C303  470pF  [C0402]
C304  470pF  [C0402]
C305  470pF  [C0402]
C306  470pF  [C0402]
C307  470pF  [C0402]
C308  470pF  [C0402]
C309  470pF  [C0402]
C310  470pF  [C0402]
C311  470pF  [C0402]
C312  22uF  [C1210]
C313  22uF  [C1210]
CN2  2.54-2*5P简牛  [IDC-TH_10P-P2.54_C5665]
D1  BAT54S,215  [SOT-23-3_L3.0-W1.7-P0.95-LS2.9-BR]
D2  BAT54S,215  [SOT-23-3_L3.0-W1.7-P0.95-LS2.9-BR]
D3  BAT54S,215  [SOT-23-3_L3.0-W1.7-P0.95-LS2.9-BR]
D4  BAT54S,215  [SOT-23-3_L3.0-W1.7-P0.95-LS2.9-BR]
D5  SS14  [SMA_L4.2-W2.6-LS5.3-RD]
D6  IP4220CZ6  [SOT-23-6_L2.9-W1.6-P0.95-LS2.7-BL]
D7  RClamp0524P.TCT  [SLP2510P8_L2.5-W1.0-P0.50-BL]
D8  RClamp0524P.TCT  [SLP2510P8_L2.5-W1.0-P0.50-BL]
D11  SS14  [SMA_L4.2-W2.6-LS5.3-RD]
D12  IP4220CZ6  [SOT-23-6_L2.9-W1.6-P0.95-LS2.7-BL]
D13  RClamp0524P.TCT  [SLP2510P8_L2.5-W1.0-P0.50-BL]
D14  RClamp0524P.TCT  [SLP2510P8_L2.5-W1.0-P0.50-BL]
D16  IP4220CZ6  [SOT-23-6_L2.9-W1.6-P0.95-LS2.7-BL]
D17  B230A-13-F  [SMA_L4.4-W2.6-LS5.0-RD]
D20  BZT52H-B5V6,115  [SOD-123F_L2.6-W1.6-LS3.5-RD]
D21  BZT52H-B5V6,115  [SOD-123F_L2.6-W1.6-LS3.5-RD]
D22  BAT54A,215  [SOT-23-3_L3.0-W1.7-P0.95-LS2.9-BR]
D23  BAT54A,215  [SOT-23-3_L3.0-W1.7-P0.95-LS2.9-BR]
D24  BAT54A,215  [SOT-23-3_L3.0-W1.7-P0.95-LS2.9-BR]
D25  BAT54A,215  [SOT-23-3_L3.0-W1.7-P0.95-LS2.9-BR]
DC3  DC-091-A250  [DC-IN-TH_DC-091-A250]
DSUB1  DZ11A51-H8R1-4F  [DSUB-TH_DZ11A5X-H8R1-4F]
F1  1812L200THPR  [F1812]
F2  1812L300MR  [F1812]
L1  GZ2012D601TF  [L0805]
L2  BLM18RK601SN1D  [L0603]
L3  BLM18RK601SN1D  [L0603]
L4  BLM18RK601SN1D  [L0603]
L5  BLM18RK601SN1D  [L0603]
L6  BLM18RK601SN1D  [L0603]
L7  BLM18RK601SN1D  [L0603]
L8  BLM18RK601SN1D  [L0603]
L22  2.2uH  [IND-SMD_L7.0-W6.6]
L23  BLM18SG121TN1D  [L0603]
L24  2.2uH  [IND-SMD_L7.0-W6.6]
L25  BLM18SG121TN1D  [L0603]
L26  2.2uH  [IND-SMD_L7.0-W6.6]
L27  BLM18SG121TN1D  [L0603]
L28  2.2uH  [IND-SMD_L7.0-W6.6]
L29  2.2uH  [IND-SMD_L7.0-W6.6]
L30  2.2uH  [IND-SMD_L7.0-W6.6]
L31  2.2uH  [IND-SMD_L7.0-W6.6]
L32  2.2uH  [IND-SMD_L7.0-W6.6]
L33  BLM18RK601SN1D  [L0603]
L34  2.2uH  [IND-SMD_L7.0-W6.6]
LED1  19-22/R6GHC-A32/2T  [LED-ARRAY-SMD_4P-L1.9-W1.6-BL-CW]
Q1  2N7002  [SOT-23-3_L2.9-W1.3-P1.90-LS2.4-BR]
Q2  2N7002  [SOT-23-3_L2.9-W1.3-P1.90-LS2.4-BR]
Q3  2N7002  [SOT-23-3_L2.9-W1.3-P1.90-LS2.4-BR]
Q4  2N7002  [SOT-23-3_L2.9-W1.3-P1.90-LS2.4-BR]
Q5  2N7002  [SOT-23-3_L2.9-W1.3-P1.90-LS2.4-BR]
Q6  2N7002  [SOT-23-3_L2.9-W1.3-P1.90-LS2.4-BR]
Q7  2N7002  [SOT-23-3_L2.9-W1.3-P1.90-LS2.4-BR]
Q8  2N7002  [SOT-23-3_L2.9-W1.3-P1.90-LS2.4-BR]
Q9  2N7002  [SOT-23-3_L2.9-W1.3-P1.90-LS2.4-BR]
Q10  2N7002  [SOT-23-3_L2.9-W1.3-P1.90-LS2.4-BR]
Q11  2N7002  [SOT-23-3_L2.9-W1.3-P1.90-LS2.4-BR]
Q12  2N7002  [SOT-23-3_L2.9-W1.3-P1.90-LS2.4-BR]
Q13  2N7002  [SOT-23-3_L2.9-W1.3-P1.90-LS2.4-BR]
Q14  2N7002  [SOT-23-3_L2.9-W1.3-P1.90-LS2.4-BR]
Q15  2N7002  [SOT-23-3_L2.9-W1.3-P1.90-LS2.4-BR]
Q16  2N7002  [SOT-23-3_L2.9-W1.3-P1.90-LS2.4-BR]
R1  4.7kΩ  [R0402]
R2  4.7kΩ  [R0402]
R5  4.7kΩ  [R0402]
R6  33Ω  [R0402]
R7  33Ω  [R0402]
R11  33Ω  [R0402]
R12  33Ω  [R0402]
R13  33Ω  [R0402]
R14  33Ω  [R0402]
R15  4.7kΩ  [R0402]
R16  4.7kΩ  [R0402]
R17  4.7kΩ  [R0402]
R18  300Ω  [R0402]
R19  33Ω  [R0402]
R20  33Ω  [R0402]
R21  33Ω  [R0402]
R22  33Ω  [R0402]
R23  4.7kΩ  [R0402]
R24  100kΩ  [R0402]
R25  100kΩ  [R0402]
R26  240Ω  [R0402]
R27  51Ω  [R0402]
R29  51Ω  [R0402]
R30  51Ω  [R0402]
R32  51Ω  [R0402]
R33  51Ω  [R0402]
R34  51Ω  [R0402]
R35  51Ω  [R0402]
R36  51Ω  [R0402]
R37  51Ω  [R0402]
R38  51Ω  [R0402]
R39  51Ω  [R0402]
R40  51Ω  [R0402]
R41  51Ω  [R0402]
R42  51Ω  [R0402]
R43  51Ω  [R0402]
R44  51Ω  [R0402]
R45  51Ω  [R0402]
R46  51Ω  [R0402]
R47  51Ω  [R0402]
R48  51Ω  [R0402]
R49  51Ω  [R0402]
R50  51Ω  [R0402]
R51  4.7kΩ  [R0402]
R52  4.7kΩ  [R0402]
R53  240Ω  [R0402]
R54  51Ω  [R0402]
R56  51Ω  [R0402]
R57  51Ω  [R0402]
R59  51Ω  [R0402]
R60  51Ω  [R0402]
R61  51Ω  [R0402]
R62  51Ω  [R0402]
R63  51Ω  [R0402]
R64  51Ω  [R0402]
R65  51Ω  [R0402]
R66  51Ω  [R0402]
R67  51Ω  [R0402]
R68  51Ω  [R0402]
R69  51Ω  [R0402]
R70  51Ω  [R0402]
R71  51Ω  [R0402]
R72  51Ω  [R0402]
R73  51Ω  [R0402]
R74  51Ω  [R0402]
R75  51Ω  [R0402]
R76  51Ω  [R0402]
R77  51Ω  [R0402]
R78  10kΩ  [RES-ADJ-SMD_3224W]
R80  560Ω  [R0402]
R81  10kΩ  [R0402]
R82  10kΩ  [R0402]
R83  10kΩ  [R0402]
R84  75Ω  [R0603]
R85  75Ω  [R0603]
R86  75Ω  [R0603]
R87  1kΩ  [R0402]
R88  2.7kΩ  [R0402]
R89  2.7kΩ  [R0402]
R90  2.7kΩ  [R0402]
R91  2.7kΩ  [R0402]
R92  2.7kΩ  [R0402]
R93  2.7kΩ  [R0402]
R94  2.7kΩ  [R0402]
R95  2.7kΩ  [R0402]
R96  10kΩ  [R0402]
R97  10kΩ  [R0402]
R98  510Ω  [R0402]
R102  1kΩ  [R0402]
R103  1kΩ  [R0402]
R104  2.7kΩ  [R0402]
R105  2.7kΩ  [R0402]
R106  2.7kΩ  [R0402]
R107  2.7kΩ  [R0402]
R108  2.7kΩ  [R0402]
R109  2.7kΩ  [R0402]
R110  2.7kΩ  [R0402]
R111  2.7kΩ  [R0402]
R112  1kΩ  [R0402]
R133  100kΩ  [R0603]
R134  180kΩ  [R0603]
R135  560kΩ  [R0402]
R136  100kΩ  [R0603]
R137  180kΩ  [R0603]
R138  158kΩ  [R0402]
R139  100kΩ  [R0402]
R140  1.8kΩ  [R0402]
R141  10kΩ  [R0402]
R142  5kΩ  [R0603]
R143  3.3kΩ  [R0805]
R144  3.3kΩ  [R0805]
R145  3.3kΩ  [R0805]
R146  100kΩ  [R0603]
R147  3.3kΩ  [R0805]
R148  3.3kΩ  [R0805]
R149  300Ω  [R0402]
R150  10kΩ  [R0402]
R151  33Ω  [R0402]
R152  33Ω  [R0402]
R153  33Ω  [R0402]
R154  300Ω  [R0402]
R155  100Ω  [R0402]
R156  100Ω  [R0402]
R159  33Ω  [R0402]
R160  33Ω  [R0402]
R168  10kΩ  [R0402]
R169  10kΩ  [R0402]
R184  33Ω  [R0402]
R185  300Ω  [R0402]
R186  100Ω  [R0402]
R187  100Ω  [R0402]
R188  100Ω  [R0402]
R189  100Ω  [R0402]
R190  33Ω  [R0402]
R196  300Ω  [R0402]
R197  300Ω  [R0402]
R198  300Ω  [R0402]
RN1  33Ω  [RES-ARRAY-SMD_0402-8P-L2.0-W1.0-BL]
RN2  10kΩ  [RES-ARRAY-SMD_0603-8P-L3.2-W1.6-BL]
RN3  10kΩ  [RES-ARRAY-SMD_0603-8P-L3.2-W1.6-BL]
RN4  33Ω  [RES-ARRAY-SMD_0402-8P-L2.0-W1.0-BL]
RN5  33Ω  [RES-ARRAY-SMD_0402-8P-L2.0-W1.0-BL]
RN6  33Ω  [RES-ARRAY-SMD_0402-8P-L2.0-W1.0-BL]
RN7  33Ω  [RES-ARRAY-SMD_0402-8P-L2.0-W1.0-BL]
RN8  33Ω  [RES-ARRAY-SMD_0402-8P-L2.0-W1.0-BL]
RN9  33Ω  [RES-ARRAY-SMD_0402-8P-L2.0-W1.0-BL]
RN11  33Ω  [RES-ARRAY-SMD_0402-8P-L2.0-W1.0-BL]
RN12  33Ω  [RES-ARRAY-SMD_0402-8P-L2.0-W1.0-BL]
RN13  33Ω  [RES-ARRAY-SMD_0402-8P-L2.0-W1.0-BL]
RN14  33Ω  [RES-ARRAY-SMD_0402-8P-L2.0-W1.0-BL]
RN15  33Ω  [RES-ARRAY-SMD_0402-8P-L2.0-W1.0-BL]
RN16  33Ω  [RES-ARRAY-SMD_0402-8P-L2.0-W1.0-BL]
RN17  33Ω  [RES-ARRAY-SMD_0402-8P-L2.0-W1.0-BL]
RN18  33Ω  [RES-ARRAY-SMD_0402-8P-L2.0-W1.0-BL]
RN19  33Ω  [RES-ARRAY-SMD_0402-8P-L2.0-W1.0-BL]
RN20  33Ω  [RES-ARRAY-SMD_0402-8P-L2.0-W1.0-BL]
RN21  33Ω  [RES-ARRAY-SMD_0402-8P-L2.0-W1.0-BL]
RN22  33Ω  [RES-ARRAY-SMD_0402-8P-L2.0-W1.0-BL]
RN23  33Ω  [RES-ARRAY-SMD_0402-8P-L2.0-W1.0-BL]
RN24  33Ω  [RES-ARRAY-SMD_0402-8P-L2.0-W1.0-BL]
RN25  33Ω  [RES-ARRAY-SMD_0402-8P-L2.0-W1.0-BL]
RN27  33Ω  [RES-ARRAY-SMD_0402-8P-L2.0-W1.0-BL]
RN28  33Ω  [RES-ARRAY-SMD_0402-8P-L2.0-W1.0-BL]
SW1  DSHP04TSGET  [SW-SMD_8P-L6.7-W5.4-P1.27-LS8.4]
SW2  DSHP04TSGET  [SW-SMD_8P-L6.7-W5.4-P1.27-LS8.4]
SW3  SKPMBHE010  [KEY-SMD_2P-L6.0-W6.0-P6.00]
SW4  SKPMBHE010  [KEY-SMD_2P-L6.0-W6.0-P6.00]
SW5  SKPMBHE010  [KEY-SMD_2P-L6.0-W6.0-P6.00]
U2  TFP401APZPR  [HTQFP-100_L14.0-W14.0-P0.50-LS16.0-BL-EP6.2]
U3  TFP410PAPR  [HTQFP-64_L10.0-W10.0-P0.50-LS12.0-BL-EP5.0]
U4  ADV7125BCPZ170-RL  [LFCSP-48_L7.0-W7.0-P0.50-BL-EP5.1]
U5  MT41K256M16TW-107:P  [FBGA-96_L14.0-W8.0-R16-C6-P0.80-TL]
U7  TPS51200DRCR  [WSON-10_L3.0-W3.0-P0.50-BL-EP]
U8  XC6SLX45-3FGG484I  [FBGA-484_L23.0-W23.0-R22-C22-P1.00-TL]  (parts A,B,C,D,E,F,G,H of 8)
U11  1625854-2  [TEST-RING]
U12  MT41K256M16TW-107:P  [FBGA-96_L14.0-W8.0-R16-C6-P0.80-TL]
U13  AD1580ARTZ-REEL7  [SOT-23-3_L2.9-W1.6-P1.90-LS2.8-BR]
U14  50Ω  [R0402]
U15  BLM18PG121SN1D  [L0603]
U16  BLM18PG121SN1D  [L0603]
U17  BLM18PG121SN1D  [L0603]
U18  1812L160PR  [F1812]
U19  P82B96TD,118  [SOIC-8_L4.9-W3.9-P1.27-LS6.0-BL]
U21  5kΩ  [R0603]
U22  BLM18PG121SN1D  [L0603]
U23  BLM18PG121SN1D  [L0603]
U24  1812L160PR  [F1812]
U25  5kΩ  [R0603]
U26  5kΩ  [R0603]
U27  5kΩ  [R0603]
U31  5kΩ  [R0603]
U33  AT24C02C-SSHM-T  [SOIC-8_L5.0-W4.0-P1.27-LS6.0-BL]
U69  TPS62130ARGTT  [TQFN-16_L3.0-W3.0-P0.50-TL-EP1.7]
U70  TPS62130ARGTT  [TQFN-16_L3.0-W3.0-P0.50-TL-EP1.7]
U71  TPS54620RHLR  [VQFN-14_L3.5-W3.5-P0.50-TL-EP_TPS54622RHLT]
U72  1625854-2  [TEST-RING]
U73  1625854-2  [TEST-RING]
U74  1625854-2  [TEST-RING]
U75  1625854-2  [TEST-RING]
U76  1625854-2  [TEST-RING]
U77  APT3216SGC  [LED1206-RD]
U78  APT3216SGC  [LED1206-RD]
U79  APT3216SGC  [LED1206-RD]
U80  APT3216SGC  [LED1206-RD]
U81  APT3216SGC  [LED1206-RD]
U82  SMTSO3050CTJ  [SMD_SMTSO3060CTJ]
U83  SMTSO3050CTJ  [SMD_SMTSO3060CTJ]
U84  SMTSO3050CTJ  [SMD_SMTSO3060CTJ]
U85  SMTSO3050CTJ  [SMD_SMTSO3060CTJ]
U86  MARK  [MARK]
U87  MARK  [MARK]
U88  MARK  [MARK]
U89  MARK  [MARK]
U90  MARK  [MARK]
U91  MARK  [MARK]
U92  MARK  [MARK]
U93  MARK  [MARK]
U94  MARK  [MARK]
U95  MARK  [MARK]
U96  MARK  [MARK]
U97  MARK  [MARK]
U98  MARK  [MARK]
U99  MARK  [MARK]
U100  SN74LVC1G06MDCKREP  [SC-70-5_L2.0-W1.3-P0.65-LS2.1-BL]
U101  5kΩ  [R0603]
U102  5kΩ  [R0603]
U121  5kΩ  [R0603]
U122  5kΩ  [R0603]
U123  W25Q128JVSIQ  [SOIC-8_L5.3-W5.3-P1.27-LS8.0-BL]
USB2  HDMI-001C  [HDMI-SMD_HDMI-001C]
USB3  HDMI-001C  [HDMI-SMD_HDMI-001C]
X1  27MHz  [OSC-SMD_4P-L3.2-W2.5-BL]
X2  50MHz  [OSC-SMD_4P-L3.2-W2.5-BL]

## Blocks framed on the sheet
避免反向电流: D22
Q7 Q8 和U19选装一个: Q7 Q8
避免反向电流: D23
NC: C112-C117
NC: R102

## Nets
401_AVDD: C173.1 C176.2 C181.1 C188.2 C189.2 C190.2 L8.2 U2.82(AVDD) U2.84(AVDD) U2.88(AVDD) U2.95(AVDD)
401_DVDD: C157.1 C158.1 C166.2 C178.1 L5.2 Q11.1(G) Q12.1(G) R108.2 R109.2 RN3.1 RN3.2 RN3.3 RN3.4 U2.6(DVDD) U2.38(DVDD) U2.67(DVDD) U2.99(RSVD)
401_OVDD: C159.1 C167.2 C169.2 C179.1 C185.2 C186.2 C187.2 L6.2 U2.18(OVDD) U2.29(OVDD) U2.43(OVDD) U2.57(OVDD) U2.78(OVDD)
401_PVDD: C162.1 C171.2 C180.1 L7.2 U2.97(PVDD)
401_PWR: C214.2 L5.1 L6.1 L7.1 L8.1 L31.2
410_DVDD: C129.1 C141.2 C143.2 C182.1 C191.2 L2.2 Q7.1(G) Q8.1(G) R102.2 R104.2 R105.2 RN2.1 RN2.2 RN2.3 RN2.4 U3.1(DVDD) U3.10(PD#) U3.12(DVDD) U3.33(DVDD) U21.1 U101.2 U121.2
410_PVDD: C128.2 C135.1 C136.1 C145.2 C146.2 C184.1 L4.2 U3.18(PVDD)
410_PWR: C212.2 L2.1 L3.1 L4.1 L30.2
410_TVDD: C132.1 C133.1 C142.2 C144.2 C183.1 L3.2 R98.2 U3.23(TVDD) U3.29(TVDD)
7125_3V3: C106.1 C107.2 C108.1 C109.2 C110.2 L33.2 Q1.1(G) Q2.1(G) Q3.1(G) Q4.1(G) R81.1 R82.1 R83.2 R87.2 R88.2 R89.2 R92.2 R93.2 U4.13(VAA) U4.29(VAA) U4.30(VAA)
FPGA_3V3: C1.2 C2.2 C30.2 C31.2 C32.2 C33.2 C34.2 C35.2 C36.2 C37.2 C38.2 C39.2 C40.2 C41.2 C54.2 C55.2 C56.2 C57.2 C58.2 C59.2 C60.2 C61.2 C62.2 C63.2 C64.2 C65.2 C209.2 C310.2 CN2.4 CN2.6 D1.2(K) D2.2(K) D3.2(K) D4.2(K) L29.2 R5.2 R15.2 R16.2 R17.2 R18.1 R23.2 R24.2 R150.2 R154.1 R168.2 R169.2 U8.AA3(VCCO_2) U8.AA7(VCCO_2) U8.AA11(VCCO_2) U8.AA15(VCCO_2) U8.AA19(VCCO_2) U8.AA22(IO_L1N_M0_CMPMISO_2) U8.B4(VCCO_0) U8.B7(VCCO_0) U8.B11(VCCO_0) U8.B15(VCCO_0) U8.B19(VCCO_0) U8.E9(VCCO_0) U8.E13(VCCO_0) U8.E17(VCCO_0) U8.G10(VCCO_0) U8.G14(VCCO_0) U8.T9(VCCO_2) U8.T13(VCCO_2) U8.V8(VCCO_2) U8.V12(VCCO_2) U8.V16(VCCO_2) U8.W5(VCCO_2) U22.1 U23.1 U100.5(VCC) U123.8(VCC)
GND: C1.1 C2.1 C3.1 C4.1 C5.1 C6.1 C7.1 C8.1 C9.1 C10.1 C11.1 C12.1 C13.1 C14.1 C15.1 C16.1 C17.1 C18.1 C19.1 C20.1 C21.1 C22.1 C23.1 C24.1 C25.1 C29.1 C30.1 C31.1 C32.1 C33.1 C34.1 C35.1 C36.1 C37.1 C38.1 C39.1 C40.1 C41.1 C42.1 C43.1 C44.1 C45.1 C46.1 C47.1 C48.1 C49.1 C50.1 C51.1 C52.1 C53.1 C54.1 C55.1 C56.1 C57.1 C58.1 C59.1 C60.1 C61.1 C62.1 C63.1 C64.1 C65.1 C66.1 C67.1 C68.1 C69.1 C70.1 C71.1 C72.1 C73.1 C74.1 C75.1 C76.1 C77.1 C78.1 C79.1 C80.1 C81.1 C82.1 C83.1 C84.1 C85.1 C86.1 C87.1 C88.1 C89.1 C90.1 C91.1 C92.1 C93.1 C94.1 C95.1 C96.1 C97.1 C98.1 C99.1 C100.1 C101.1 C102.2 C103.2 C104.2 C105.2 C106.2 C107.1 C108.2 C109.1 C111.1 C112.1 C113.1 C114.1 C115.1 C116.1 C117.1 C118.1 C119.2 C120.1 C121.1 C122.1 C123.1 C124.2 C125.1 C128.1 C129.2 C132.2 C133.2 C135.2 C136.2 C141.1 C142.1 C143.1 C144.1 C145.1 C146.1 C147.1 C148.1 C149.1 C150.1 C153.2 C157.2 C158.2 C159.2 C162.2 C166.1 C167.1 C169.1 C171.1 C173.2 C176.1 C178.2 C179.2 C180.2 C181.2 C182.2 C183.2 C184.2 C185.1 C186.1 C187.1 C188.1 C189.1 C190.1 C191.1 C192.2 C193.1 C194.1 C195.1 C196.1 C197.1 C198.1 C199.1 C200.1 C201.1 C204.1 C205.1 C206.1 C207.1 C208.1 C209.1 C210.1 C211.1 C212.1 C213.1 C214.1 C215.1 C216.1 C217.2 C218.2 C219.2 C220.1 C221.1 C222.1 C223.1 C224.1 C225.1 C226.1 C227.1 C228.1 C229.1 C230.1 C231.1 C232.1 C233.1 C234.1 C235.1 C236.1 C237.1 C238.1 C239.1 C240.1 C241.1 C242.1 C243.1 C244.1 C245.1 C246.1 C247.1 C248.1 C249.1 C250.1 C251.1 C259.2 C260.2 C261.1 C262.1 C263.1 C264.1 C265.1 C266.1 C267.1 C268.1 C269.1 C270.1 C271.1 C272.1 C273.1 C274.1 C275.1 C276.1 C277.1 C278.1 C279.1 C280.1 C281.1 C282.1 C283.1 C284.1 C285.1 C286.1 C287.1 C288.1 C289.1 C290.1 C291.1 C292.1 C293.1 C294.1 C295.1 C296.1 C297.1 C298.1 C299.1 C300.1 C301.1 C302.1 C303.1 C304.1 C305.1 C306.1 C307.1 C308.1 C309.1 C310.1 C311.1 C312.1 C313.1 CN2.2 CN2.10 D1.1(A) D2.1(A) D3.1(A) D4.1(A) D6.2 D7.3(GND) D7.8(GND) D8.3(GND) D8.8(GND) D12.2 D13.3(GND) D13.8(GND) D14.3(GND) D14.8(GND) D16.2 D20.2(A) D21.2(A) DC3.4 DC3.6 DSUB1.5 DSUB1.6 DSUB1.7 DSUB1.8 DSUB1.10 DSUB1.16 DSUB1.17 LED1.2(K) Q5.2(S) Q6.2(S) Q9.2(S) Q10.2(S) Q13.2(S) Q14.2(S) Q15.2(S) Q16.2(S) R1.2 R2.2 R25.1 R26.2 R51.2 R52.2 R53.2 R78.3 R84.1 R85.1 R86.1 R97.1 R103.1 R134.1 R137.1 R139.1 R141.1 R149.1 R185.1 R186.2 R187.2 R188.2 R189.2 R196.1 R197.1 R198.1 SW1.5(B4) SW1.6(B3) SW1.7(B2) SW1.8(B1) SW2.5(B4) SW2.6(B3) SW2.7(B2) SW2.8(B1) U2.5(GND) U2.19(OGND) U2.28(OGND) U2.39(GND) U2.45(OGND) U2.58(OGND) U2.68(GND) U2.76(OGND) U2.79(AGND) U2.83(AGND) U2.87(AGND) U2.89(AGND) U2.92(AGND) U2.98(PGND) U2.101(EP) U3.16(DGND) U3.17(PGND) U3.20(TGND) U3.26(TGND) U3.32(TGND) U3.34(RESERVED) U3.48(DGND) U3.56(IDCK-) U3.64(DGND) U3.65(EP) U4.1(GND) U4.2(GND) U4.14(GND) U4.15(GND) U4.25(GND) U4.26(GND) U4.27(IOB#) U4.31(IOG#) U4.33(IOR#) U4.39(GND) U4.40(GND) U4.49(EP) U5.A9(VSS) U5.B1(VSSQ) U5.B3(VSS) U5.B9(VSSQ) U5.D1(VSSQ) U5.D8(VSSQ) U5.E1(VSS) U5.E2(VSSQ) U5.E8(VSSQ) U5.F9(VSSQ) U5.G1(VSSQ) U5.G8(VSS) U5.G9(VSSQ) U5.J2(VSS) U5.J8(VSS) U5.L2(CS#) U5.M1(VSS) U5.M9(VSS) U5.P1(VSS) U5.P9(VSS) U5.T1(VSS) U5.T9(VSS) U7.4(PGND) U7.8(GND) U7.11(EPAD) U8.A1(GND) U8.A3(IO_L1P_HSWAPEN_0) U8.A22(GND) U8.AA5(GND) U8.AA9(GND) U8.AA13(GND) U8.AA17(GND) U8.AB1(GND) U8.AB22(GND) U8.B5(GND) U8.B9(GND) U8.B13(GND) U8.B17(GND) U8.D4(GND) U8.D18(GND) U8.E2(GND) U8.E7(GND) U8.E11(GND) U8.E15(GND) U8.E21(GND) U8.G5(GND) U8.G18(GND) U8.H7(GND) U8.J2(GND) U8.J9(GND) U8.J11(GND) U8.J13(GND) U8.J15(GND) U8.J21(GND) U8.K10(GND) U8.K12(GND) U8.K14(GND) U8.L5(GND) U8.L9(GND) U8.L11(GND) U8.L13(GND) U8.L18(GND) U8.M10(GND) U8.M12(GND) U8.M14(GND) U8.N2(GND) U8.N9(GND) U8.N11(GND) U8.N13(GND) U8.N15(SUSPEND) U8.N17(GND) U8.N21(GND) U8.P10(GND) U8.P12(GND) U8.P14(GND) U8.R5(GND) U8.R18(GND) U8.U2(GND) U8.U7(GND) U8.U15(IO_L13P_M1_2) U8.U21(GND) U8.V4(GND) U8.V10(GND) U8.V14(GND) U8.W7(GND) U8.W16(GND) U8.W19(GND) U12.A9(VSS) U12.B1(VSSQ) U12.B3(VSS) U12.B9(VSSQ) U12.D1(VSSQ) U12.D8(VSSQ) U12.E1(VSS) U12.E2(VSSQ) U12.E8(VSSQ) U12.F9(VSSQ) U12.G1(VSSQ) U12.G8(VSS) U12.G9(VSSQ) U12.J2(VSS) U12.J8(VSS) U12.L2(CS#) U12.M1(VSS) U12.M9(VSS) U12.P1(VSS) U12.P9(VSS) U12.T1(VSS) U12.T9(VSS) U13.2(V-) U14.1 U19.4(GND) U25.1 U33.1(A0) U33.2(A1) U33.3(A2) U33.4(GND) U33.7(WP) U69.6(AGND) U69.8(DEF) U69.15(PGND) U69.16(PGND) U69.17(EP) U70.6(AGND) U70.8(DEF) U70.15(PGND) U70.16(PGND) U70.17(EP) U71.2(GND) U71.3(GND) U71.15(EP) U75.1 U76.1 U77.1(K) U82.1 U82.2 U82.3 U82.4 U83.1 U83.2 U83.3 U83.4 U84.1 U84.2 U84.3 U84.4 U85.1 U85.2 U85.3 U85.4 U100.3(GND) U102.1 U122.1 U123.4(GND) USB2.2(TMDSData2Shield) USB2.5(TMDSData1Shield) USB2.8(TMDSData0Shield) USB2.11(TMDSClockShield) USB2.17(DDC/CECGround) USB2.20(EH) USB3.2(TMDSData2Shield) USB3.5(TMDSData1Shield) USB3.8(TMDSData0Shield) USB3.11(TMDSClockShield) USB3.17(DDC/CECGround) USB3.20(EH) X1.2(GND) X2.2(GND)
VCC_1V2: C5.2 C6.2 C7.2 C8.2 C9.2 C10.2 C11.2 C12.2 C13.2 C14.2 C15.2 C16.2 C207.2 C293.2 C294.2 C295.2 C296.2 C297.2 C298.2 C299.2 C300.2 C301.2 C302.2 L27.2 U8.J8(VCCINT) U8.J10(VCCINT) U8.J12(VCCINT) U8.J14(VCCINT) U8.K9(VCCINT) U8.K11(VCCINT) U8.K13(VCCINT) U8.L10(VCCINT) U8.L12(VCCINT) U8.L14(VCCINT) U8.M9(VCCINT) U8.M11(VCCINT) U8.M13(VCCINT) U8.N10(VCCINT) U8.N12(VCCINT) U8.N14(VCCINT) U8.P9(VCCINT) U8.P11(VCCINT) U8.P13(VCCINT) U8.R14(VCCINT) U74.1
VCC_1V5: C42.2 C43.2 C44.2 C45.2 C46.2 C47.2 C48.2 C49.2 C50.2 C51.2 C52.2 C53.2 C66.2 C67.2 C68.2 C69.2 C70.2 C71.2 C72.2 C73.2 C74.2 C75.2 C76.2 C77.2 C120.2 C123.2 C311.2 C312.2 L25.2 L34.1 R96.1 U7.2(VLDOIN) U8.C2(VCCO_3) U8.C21(VCCO_1) U8.E19(VCCO_1) U8.F4(VCCO_3) U8.F6(VCCO_3) U8.G2(VCCO_3) U8.G21(VCCO_1) U8.J5(VCCO_3) U8.J18(VCCO_1) U8.L2(VCCO_3) U8.L7(VCCO_3) U8.L16(VCCO_1) U8.L21(VCCO_1) U8.N5(VCCO_3) U8.N18(VCCO_1) U8.R2(VCCO_3) U8.R21(VCCO_1) U8.U5(VCCO_3) U8.U18(VCCO_1) U8.W2(VCCO_3) U8.W21(VCCO_1) U73.1
VCC_3V3: C125.2 C150.2 C204.2 C208.2 C210.2 C211.2 C213.2 C215.2 L1.2 L23.2 L28.1 L29.1 L30.1 L31.1 L32.1 Q9.1(G) U19.8(VCC) U26.2 U27.2 U33.8(VCC) U72.1
VCC_5V: C153.1 C192.1 C193.2 C196.2 C199.2 C217.1 C218.1 C219.1 D5.2(A) D6.5 D11.2(A) D12.5 D16.5 D17.1(K) D22.3(C) D23.3(C) D24.3(C) D25.3(C) F2.1 R112.2 R143.2 R144.2 R145.2 R147.2 R148.2 U11.1 U31.2 U69.10(AVIN) U69.11(PVIN) U69.12(PVIN) U69.13(EN) U70.10(AVIN) U70.11(PVIN) U70.12(PVIN) U70.13(EN) U71.4(PVIN) U71.5(PVIN) U71.6(VIN) U71.10(EN)
VCC_AUX: C17.2 C18.2 C19.2 C20.2 C21.2 C22.2 C23.2 C24.2 C25.2 C29.2 C205.2 C303.2 C304.2 C305.2 C306.2 C307.2 C308.2 C309.2 L28.2 U8.D16(VCCAUX) U8.F11(VCCAUX) U8.G12(VCCAUX) U8.H9(VCCAUX) U8.H15(VCCAUX) U8.K15(VCCAUX) U8.L8(VCCAUX) U8.M15(VCCAUX) U8.N8(VCCAUX) U8.R6(VCCAUX) U8.R10(VCCAUX) U8.R12(VCCAUX) U8.U11(VCCAUX) U8.V6(VCCAUX)
VDD_DDR3: C261.2 C262.2 C263.2 C264.2 C265.2 C266.2 C267.2 C268.2 C269.2 C270.2 C271.2 C272.2 C273.2 C274.2 C275.2 C276.2 C277.2 C278.2 C279.2 C280.2 C281.2 C282.2 C283.2 C284.2 C285.2 C286.2 C287.2 C288.2 C289.2 C290.2 C291.2 C292.2 C313.2 L34.2 U5.A1(VDDQ) U5.A8(VDDQ) U5.B2(VDD) U5.C1(VDDQ) U5.C9(VDDQ) U5.D2(VDDQ) U5.D9(VDD) U5.E9(VDDQ) U5.F1(VDDQ) U5.G7(VDD) U5.H2(VDDQ) U5.H9(VDDQ) U5.K2(VDD) U5.K8(VDD) U5.N1(VDD) U5.N9(VDD) U5.R1(VDD) U5.R9(VDD) U12.A1(VDDQ) U12.A8(VDDQ) U12.B2(VDD) U12.C1(VDDQ) U12.C9(VDDQ) U12.D2(VDDQ) U12.D9(VDD) U12.E9(VDDQ) U12.F1(VDDQ) U12.G7(VDD) U12.H2(VDDQ) U12.H9(VDDQ) U12.K2(VDD) U12.K8(VDD) U12.N1(VDD) U12.N9(VDD) U12.R1(VDD) U12.R9(VDD)
VDD_DDR3_REF: C102.1 C103.1 C104.1 C105.1 C124.1 U5.H1(VREFDQ) U5.M8(VREFCA) U7.6(REFOUT) U8.B3(IO_L83N_VREF_3) U8.B20(IO_L1N_A24_VREF_1) U8.H17(IO_L28N_VREF_1) U8.K8(IO_L57N_VREF_3) U8.M4(IO_L31N_VREF_3) U8.N19(IO_L53N_VREF_1) U8.Y1(IO_L1N_VREF_3) U12.H1(VREFDQ) U12.M8(VREFCA)
VTT_DDR3: C78.2 C79.2 C80.2 C81.2 C82.2 C83.2 C84.2 C85.2 C86.2 C87.2 C88.2 C89.2 C90.2 C91.2 C92.2 C93.2 C94.2 C95.2 C96.2 C97.2 C98.2 C99.2 C100.2 C101.2 C121.2 C122.2 C220.2 C221.2 C222.2 C223.2 C224.2 C225.2 C226.2 C227.2 C228.2 C229.2 C230.2 C231.2 C232.2 C233.2 C234.2 C235.2 C236.2 C237.2 C238.2 C239.2 C240.2 C241.2 C242.2 C243.2 C244.2 C245.2 C246.2 C247.2 C248.2 C249.2 C250.2 C251.2 C259.1 C260.1 R27.2 R29.2 R30.2 R32.2 R33.2 R34.2 R35.2 R36.2 R37.2 R38.2 R39.2 R40.2 R41.2 R42.2 R43.2 R44.2 R45.2 R46.2 R47.2 R48.2 R49.2 R50.2 R54.2 R56.2 R57.2 R59.2 R60.2 R61.2 R62.2 R63.2 R64.2 R65.2 R66.2 R67.2 R68.2 R69.2 R70.2 R71.2 R72.2 R73.2 R74.2 R75.2 R76.2 R77.2 U7.3(VO) U7.5(VOSNS)
27M_CLK: R152.1 X1.3(OUT)
27M_CLK_FPGA: R152.2 U8.AB13(IO_L30N_GCLK0_USERCCLK_2)
50M_CLK: R153.1 X2.3(OUTPUT)
50M_CLK_FPGA: R153.2 U8.AA12(IO_L31P_GCLK31_D14_2)
410_CTL1: RN22.6 U3.8(CTL1/A1/DK1)
410_CTL1_FPGA: RN22.3 U8.V9(IO_L50N_2)
410_CTL2: RN22.5 U3.7(CTL2/A2/DK2)
410_CTL2_FPGA: RN22.4 U8.U9(IO_L50P_2)
410_CTL3: RN1.8 U3.6(CTL3/A3/DK3)
410_CTL3_FPGA: RN1.1 U8.AB10(IO_L41N_VREF_2)
410_DE: RN1.5 U3.2(DE)
410_DE_FPGA: RN1.4 U8.Y11(IO_L32P_GCLK29_2)
410_HSYNC: RN1.6 U3.4(HSYNC)
410_HSYNC_FPGA: RN1.3 U8.Y10(IO_L44N_2)
410_VSYNC: RN1.7 U3.5(VSYNC)
410_VSYNC_FPGA: RN1.2 U8.AA10(IO_L41P_2)
7125_B0: RN17.5 U4.16(B0)
7125_B0_FPGA: RN17.4 U8.AB4(IO_L57N_2)
7125_B1: RN17.6 U4.17(B1)
7125_B1_FPGA: RN17.3 U8.AA4(IO_L57P_2)
7125_B2: RN17.7 U4.18(B2)
7125_B2_FPGA: RN17.2 U8.Y4(IO_L62N_D6_2)
7125_B3: RN17.8 U4.19(B3)
7125_B3_FPGA: RN17.1 U8.AB3(IO_L58N_2)
7125_B4: RN16.5 U4.20(B4)
7125_B4_FPGA: RN16.4 U8.W4(IO_L62P_D5_2)
7125_B5: RN16.6 U4.21(B5)
7125_B5_FPGA: RN16.3 U8.Y3(IO_L58P_2)
7125_B6: RN16.7 U4.22(B6)
7125_B6_FPGA: RN16.2 U8.AB2(IO_L64N_D9_2)
7125_B7: RN16.8 U4.23(B7)
7125_B7_FPGA: RN16.1 U8.AA2(IO_L64P_D8_2)
7125_BLK: R81.2 RN18.7 U4.11(BLANK#)
7125_BLK_FPGA: RN18.2 U8.Y5(IO_L54P_2)
7125_CLK: R184.1 U4.24(CLOCK) U14.2
7125_CLK_FPGA: R184.2 U8.AB11(IO_L32N_GCLK28_2)
7125_G0: RN20.7 U4.3(G0)
7125_G0_FPGA: RN20.2 U8.V7(IO_L46N_2)
7125_G1: RN20.8 U4.4(G1)
7125_G1_FPGA: RN20.1 U8.AB7(IO_L48N_RDWR_B_VREF_2)
7125_G2: RN19.5 U4.5(G2)
7125_G2_FPGA: RN19.4 U8.Y6(IO_L53N_2)
7125_G3: RN19.6 U4.6(G3)
7125_G3_FPGA: RN19.3 U8.AA6(IO_L49P_D3_2)
7125_G4: RN19.7 U4.7(G4)
7125_G4_FPGA: RN19.2 U8.AB6(IO_L49N_D4_2)
7125_G5: RN19.8 U4.8(G5)
7125_G5_FPGA: RN19.1 U8.W6(IO_L53P_2)
7125_G6: RN18.5 U4.9(G6)
7125_G6_FPGA: RN18.4 U8.U6(IO_L63P_2)
7125_G7: RN18.6 U4.10(G7)
7125_G7_FPGA: RN18.3 U8.AB5(IO_L54N_2)
7125_PS: R83.1 U4.38(PSAVE#)
7125_R0: RN14.7 U4.41(R0)
7125_R0_FPGA: RN14.2 U8.T10(IO_L52P_2)
7125_R1: RN14.8 U4.42(R1)
7125_R1_FPGA: RN14.1 U8.R7(IO_L60N_2)
7125_R2: RN15.5 U4.43(R2)
7125_R2_FPGA: RN15.4 U8.W9(IO_L47P_2)
7125_R3: RN15.6 U4.44(R3)
7125_R3_FPGA: RN15.3 U8.W8(IO_L46P_2)
7125_R4: RN15.7 U4.45(R4)
7125_R4_FPGA: RN15.2 U8.Y8(IO_L47N_2)
7125_R5: RN15.8 U4.46(R5)
7125_R5_FPGA: RN15.1 U8.AA8(IO_L45P_2)
7125_R6: RN20.5 U4.47(R6)
7125_R6_FPGA: RN20.4 U8.AB8(IO_L45N_2)
7125_R7: RN20.6 U4.48(R7)
7125_R7_FPGA: RN20.3 U8.T7(IO_L60P_2)
7125_SYC: R82.2 RN18.8 U4.12(SYNC#)
7125_SYC_FPGA: RN18.1 U8.V5(IO_L63N_2)
7125_VGA_HSYC: Q3.2(S) R92.1 RN24.7
7125_VGA_HSYC_FPGA: RN24.2 U8.T8(IO_L51P_2)
7125_VGA_SCL: Q2.2(S) R89.1 RN24.6
7125_VGA_SCL_FPGA: RN24.3 U8.U8(IO_L51N_2)
7125_VGA_SDA: Q1.2(S) R88.1 RN24.5
7125_VGA_SDA_FPGA: RN24.4 U8.R9(IO_L59P_2)
7125_VGA_VSYC: Q4.2(S) R93.1 RN24.8
7125_VGA_VSYC_FPGA: RN24.1 U8.R8(IO_L59N_2)
7125_VREF: C111.2 R87.1 U4.36(VREF) U13.1(V+)
BSEL: RN2.5 SW1.4(A4) U3.15(BSEL/SCL)
DFO: RN3.7 SW2.2(A2) U2.1(DFO)
DSEL: RN2.6 SW1.3(A3) U3.14(DSEL/SDA)
DVI_5V: C149.2 U24.2 USB2.18(+5VPower)
DVI_C_CLK+: D8.4(IN) D8.7(NC) U3.22(TXC+) USB2.10(TMDSClock+)
DVI_C_CLK-: D8.5(IN) D8.6(NC) U3.21(TXC-) USB2.12(TMDSClock-)
DVI_C_D0+: D8.1(IN) D8.10(NC) U3.25(TX0+) USB2.7(TMDSData0+)
DVI_C_D0-: D8.2(IN) D8.9(NC) U3.24(TX0-) USB2.9(TMDSData0-)
DVI_C_D1+: D7.4(IN) D7.7(NC) U3.28(TX1+) USB2.4(TMDSData1+)
DVI_C_D1-: D7.5(IN) D7.6(NC) U3.27(TX1-) USB2.6(TMDSData1-)
DVI_C_D2+: D7.1(IN) D7.10(NC) U3.31(TX2+) USB2.1(TMDSData2+)
DVI_C_D2-: D7.2(IN) D7.9(NC) U3.30(TX2-) USB2.3(TMDSData2-)
DVI_HPD: Q6.3(D) U8.W11(IO_L42N_2) U27.1
DVI_HPD_EXT: D12.4 Q5.1(G) U25.2 USB2.19(HotPlugDetect)
DVI_SCL: D12.1 Q8.3(D) R107.1 U19.2(RX) U19.3(TX) USB2.15(SCL)
DVI_SDA: D12.6 Q7.3(D) R106.2 U19.5(TY) U19.6(RY) USB2.16(SDA)
DW_A0: R64.1 U8.F21(IO_L37P_A7_M1A0_1) U12.N3(A0)
DW_A1: R69.1 U8.F22(IO_L37N_A6_M1A1_1) U12.P7(A1)
DW_A2: R68.1 U8.E22(IO_L35N_A10_M1A2_1) U12.P3(A2)
DW_A3: R63.1 U8.G20(IO_L39P_M1A3_1) U12.N2(A3)
DW_A4: R70.1 U8.F20(IO_L33N_A14_M1A4_1) U12.P8(A4)
DW_A5: R67.1 U8.K20(IO_L40P_GCLK11_M1A5_1) U12.P2(A5)
DW_A6: R74.1 U8.K19(IO_L40N_GCLK10_M1A6_1) U12.R8(A6)
DW_A7: R71.1 U8.E20(IO_L35P_A11_M1A7_1) U12.R2(A7)
DW_A8: R77.1 U8.C20(IO_L32P_A17_M1A8_1) U12.T8(A8)
DW_A9: R72.1 U8.C22(IO_L32N_A16_M1A9_1) U12.R3(A9)
DW_A10: R60.1 U8.G19(IO_L33P_A15_M1A10_1) U12.L7(A10/AP)
DW_A11: R73.1 U8.F19(IO_L30N_A20_M1A11_1) U12.R7(A11)
DW_A12: R65.1 U8.D22(IO_L31N_A18_M1A12_1) U12.N7(A12/BC#)
DW_A13: R75.1 U8.D19(IO_L29P_A23_M1A13_1) U12.T3(A13)
DW_A14: R76.1 U8.D20(IO_L29N_A22_M1A14_1) U12.T7(A14)
DW_BA0: R61.1 U8.J17(IO_L36P_A9_M1BA0_1) U12.M2(BA0)
DW_BA1: R66.1 U8.K17(IO_L36N_A8_M1BA1_1) U12.N8(BA1)
DW_BA2: R62.1 U8.H18(IO_L34N_A12_M1BA2_1) U12.M3(BA2)
DW_CAS: R57.1 U8.H22(IO_L41N_GCLK8_M1CASN_1) U12.K3(CAS#)
DW_CK+: R155.1 U8.H20(IO_L38P_A5_M1CLK_1) U12.J7(CK)
DW_CK-: R155.2 U8.J19(IO_L38N_A4_M1CLKN_1) U12.K7(CK#)
DW_CKE: R51.1 U8.D21(IO_L31P_A19_M1CKE_1) U12.K9(CKE)
DW_D0: U8.N20(IO_L47P_FWE_B_M1DQ0_1) U12.E3(DQ0)
DW_D1: U8.N22(IO_L47N_LDC_M1DQ1_1) U12.F7(DQ1)
DW_D2: U8.M21(IO_L46P_FCS_B_M1DQ2_1) U12.F2(DQ2)
DW_D3: U8.M22(IO_L46N_FOE_B_M1DQ3_1) U12.F8(DQ3)
DW_D4: U8.J20(IO_L43P_GCLK5_M1DQ4_1) U12.H3(DQ4)
DW_D5: U8.J22(IO_L43N_GCLK4_M1DQ5_1) U12.H8(DQ5)
DW_D6: U8.K21(IO_L44P_A3_M1DQ6_1) U12.G2(DQ6)
DW_D7: U8.K22(IO_L44N_A2_M1DQ7_1) U12.H7(DQ7)
DW_D8: U8.P21(IO_L48P_HDC_M1DQ8_1) U12.D7(DQ8)
DW_D9: U8.P22(IO_L48N_M1DQ9_1) U12.C3(DQ9)
DW_D10: U8.R20(IO_L49P_M1DQ10_1) U12.C8(DQ10)
DW_D11: U8.R22(IO_L49N_M1DQ11_1) U12.C2(DQ11)
DW_D12: U8.U20(IO_L51P_M1DQ12_1) U12.A7(DQ12)
DW_D13: U8.U22(IO_L51N_M1DQ13_1) U12.A2(DQ13)
DW_D14: U8.V21(IO_L52P_M1DQ14_1) U12.B8(DQ14)
DW_D15: U8.V22(IO_L52N_M1DQ15_1) U12.A3(DQ15)
DW_LDM: R186.1 U12.E7(LDM)
DW_LDQS+: U8.L20(IO_L45P_A1_M1LDQS_1) U12.F3(LDQS)
DW_LDQS-: U8.L22(IO_L45N_A0_M1LDQSN_1) U12.G3(LDQS#)
DW_ODT: R56.1 U8.G22(IO_L39N_M1ODT_1) U12.K1(ODT)
DW_RAS: R54.1 U8.H21(IO_L41P_GCLK9_IRDY1_M1RASN_1) U12.J3(RAS#)
DW_RST: R52.1 U8.F18(IO_L30P_A21_M1RESET_1) U12.T2(RESET#)
DW_UDM: R187.1 U12.D3(UDM)
DW_UDQS+: U8.T21(IO_L50P_M1UDQS_1) U12.C7(UDQS)
DW_UDQS-: U8.T22(IO_L50N_M1UDQSN_1) U12.B7(UDQS#)
DW_WE: R59.1 U8.H19(IO_L34P_A13_M1WE_1) U12.L3(WE#)
EDGE: U3.9(EDGE/HTPLG) U121.1 U122.2
FPGA_27M_OUT: U8.U19(IO_L70P_1)
FPGA_ADV7393_HS: U8.F17(IO_L10N_1)
FPGA_ADV7393_P0: U8.C19(IO_L1P_A25_1)
FPGA_ADV7393_P1: U8.A20(IO_L20P_1)
FPGA_ADV7393_P2: U8.A21(IO_L20N_1)
FPGA_ADV7393_P3: U8.B21(IO_L19P_1)
FPGA_ADV7393_P4: U8.B22(IO_L19N_1)
FPGA_ADV7393_P5: U8.M18(IO_L71N_1)
FPGA_ADV7393_P6: U8.M17(IO_L71P_1)
FPGA_ADV7393_P7: U8.M16(IO_L58P_1)
FPGA_ADV7393_P8: U8.P20(IO_L59N_1)
FPGA_ADV7393_P9: U8.P19(IO_L59P_1)
FPGA_ADV7393_P10: U8.W22(IO_L60N_1)
FPGA_ADV7393_P11: U8.T20(IO_L74N_DOUT_BUSY_1)
FPGA_ADV7393_P12: U8.V20(IO_L70N_1)
FPGA_ADV7393_P13: U8.W20(IO_L60P_1)
FPGA_ADV7393_P14: U8.P18(IO_L73P_1)
FPGA_ADV7393_P15: U8.P17(IO_L72P_1)
FPGA_ADV7393_RESET: U8.T19(IO_L74P_AWAKE_1)
FPGA_ADV7393_SCL: U8.R19(IO_L73N_1)
FPGA_ADV7393_SDA: U8.N16(IO_L72N_1)
FPGA_ADV7393_VS: U8.F16(IO_L10P_1)
FPGA_DONE: LED1.4(A) R18.2 U8.Y22(DONE_2) U100.2(A)
FPGA_DVI_SCL: Q8.2(S) R105.1 U8.AA21(IO_L2P_CMPCLK_2) U19.1(SX)
FPGA_DVI_SDA: Q7.2(S) R104.1 U8.AB21(IO_L2N_CMPMOSI_2) U19.7(SY)
FPGA_RXD: R160.2 U8.R15(IO_L10N_2)
FPGA_TCK: D4.3(AK) R22.2 U8.G15(TCK)
FPGA_TDI: D3.3(AK) R21.2 U8.E18(TDI)
FPGA_TDO: D2.3(AK) R20.2 U8.A19(TDO)
FPGA_TMS: D1.3(AK) R19.2 U8.C18(TMS)
FPGA_TXD: R159.2 U8.V17(IO_L11P_2)
HDMI_SCL: Q12.2(S) R109.1 U8.A13(IO_L38N_VREF_0) U33.6(SCL)
HDMI_SDA: Q11.2(S) R108.1 U8.A17(IO_L64N_SCP4_0) U33.5(SDA)
HSYC: D6.4 DSUB1.13 Q3.3(D) R94.2
IN_5V: D21.1(C) F1.2 USB3.18(+5VPower)
IN_HPD: D16.4 Q10.3(D) R112.1 USB3.19(HotPlugDetect)
IN_SCL: D16.1 Q12.3(D) R111.1 USB3.15(SCL)
IN_SDA: D16.6 Q11.3(D) R110.2 USB3.16(SDA)
ISEL: RN2.7 SW1.2(A2) U3.13(ISEL/RST#)
MSEN: RN2.8 SW1.1(A1) U3.11(MSEN/PO1) U21.2
OCK_INV: RN3.8 SW2.1(A1) U2.100(OCK_INV)
PIXS: RN3.5 SW2.4(A4) U2.4(PIXS)
QSPI_CCLK: R11.1 R24.1 R25.2 U123.6(CLK)
QSPI_CS: R12.1 R15.1 U123.1(CS#)
QSPI_DIN: R7.1 U123.2(DO)
QSPI_HOLD: R13.1 R16.1 U123.7(IO3)
QSPI_OUT: R6.1 U123.5(DI)
QSPI_WP: R14.1 R17.1 U123.3(IO2)
RXD: R160.1
ST: RN3.6 SW2.3(A3) U2.3(ST)
TCK: CN2.1 R22.1
TDI: CN2.9 R21.1
TDO: CN2.3 R20.1
TFP401_C+: D14.4(IN) D14.7(NC) U2.93(RxC+) USB3.10(TMDSClock+)
TFP401_C-: D14.5(IN) D14.6(NC) U2.94(RxC−) USB3.12(TMDSClock-)
TFP401_CTL1: RN13.5 U2.40(CTL1)
TFP401_CTL1_FPGA: RN13.4 U8.A16(IO_L63N_SCP6_0)
TFP401_CTL2: RN13.6 U2.41(CTL2)
TFP401_CTL2_FPGA: RN13.3 U8.B16(IO_L63P_SCP7_0)
TFP401_CTL3: RN13.7 U2.42(CTL3)
TFP401_CTL3_FPGA: RN13.2 U8.D17(IO_L66N_SCP0_0)
TFP401_D0: RN7.5 U2.10(QE0)
TFP401_D0+: D14.1(IN) D14.10(NC) U2.90(Rx0+) USB3.7(TMDSData0+)
TFP401_D0-: D14.2(IN) D14.9(NC) U2.91(Rx0−) USB3.9(TMDSData0-)
TFP401_D0_FPGA: RN7.4 U8.C5(IO_L2P_0)
TFP401_D1: RN7.6 U2.11(QE1)
TFP401_D1+: D13.4(IN) D13.7(NC) U2.85(Rx1+) USB3.4(TMDSData1+)
TFP401_D1-: D13.5(IN) D13.6(NC) U2.86(Rx1−) USB3.6(TMDSData1-)
TFP401_D1_FPGA: RN7.3 U8.A5(IO_L2N_0)
TFP401_D2: RN7.7 U2.12(QE2)
TFP401_D2+: D13.1(IN) D13.10(NC) U2.80(Rx2+) USB3.1(TMDSData2+)
TFP401_D2-: D13.2(IN) D13.9(NC) U2.81(Rx2−) USB3.3(TMDSData2-)
TFP401_D2_FPGA: RN7.2 U8.D6(IO_L3P_0)
TFP401_D3: RN7.8 U2.13(QE3)
TFP401_D3_FPGA: RN7.1 U8.C6(IO_L3N_0)
TFP401_D4: RN8.5 U2.14(QE4)
TFP401_D4_FPGA: RN8.4 U8.A6(IO_L4N_0)
TFP401_D5: RN8.6 U2.15(QE5)
TFP401_D5_FPGA: RN8.3 U8.B6(IO_L4P_0)
TFP401_D6: RN8.7 U2.16(QE6)
TFP401_D6_FPGA: RN8.2 U8.C7(IO_L5P_0)
TFP401_D7: RN8.8 U2.17(QE7)
TFP401_D7_FPGA: RN8.1 U8.A7(IO_L5N_0)
TFP401_D8: RN9.5 U2.20(QE8)
TFP401_D8_FPGA: RN9.4 U8.D7(IO_L32P_0)
TFP401_D9: RN9.6 U2.21(QE9)
TFP401_D9_FPGA: RN9.3 U8.D8(IO_L32N_0)
TFP401_D10: RN9.7 U2.22(QE10)
TFP401_D10_FPGA: RN9.2 U8.A8(IO_L6N_0)
TFP401_D11: RN9.8 U2.23(QE11)
TFP401_D11_FPGA: RN9.1 U8.B8(IO_L6P_0)
TFP401_D12: RN28.5 U2.24(QE12)
TFP401_D12_FPGA: RN28.4 U8.C8(IO_L7N_0)
TFP401_D13: RN28.6 U2.25(QE13)
TFP401_D13_FPGA: RN28.3 U8.A9(IO_L8N_VREF_0)
TFP401_D14: RN28.7 U2.26(QE14)
TFP401_D14_FPGA: RN28.2 U8.C9(IO_L8P_0)
TFP401_D15: RN28.8 U2.27(QE15)
TFP401_D15_FPGA: RN28.1 U8.D9(IO_L7P_0)
TFP401_D16: RN11.5 U2.30(QE16)
TFP401_D16_FPGA: RN11.4 U8.C14(IO_L49N_0)
TFP401_D17: RN11.6 U2.31(QE17)
TFP401_D17_FPGA: RN11.3 U8.B14(IO_L50P_0)
TFP401_D18: RN11.7 U2.32(QE18)
TFP401_D18_FPGA: RN11.2 U8.A14(IO_L50N_0)
TFP401_D19: RN11.8 U2.33(QE19)
TFP401_D19_FPGA: RN11.1 U8.D15(IO_L62P_0)
TFP401_D20: RN12.5 U2.34(QE20)
TFP401_D20_FPGA: RN12.4 U8.C15(IO_L51P_0)
TFP401_D21: RN12.6 U2.35(QE21)
TFP401_D21_FPGA: RN12.3 U8.A15(IO_L51N_0)
TFP401_D22: RN12.7 U2.36(QE22)
TFP401_D22_FPGA: RN12.2 U8.E16(IO_L66P_SCP1_0)
TFP401_D23: RN12.8 U2.37(QE23)
TFP401_D23_FPGA: RN12.1 U8.C16(IO_L62N_VREF_0)
TFP401_DE: RN21.5 U2.46(DE)
TFP401_DE_FPGA: RN21.4 U8.C17(IO_L64P_SCP5_0)
TFP401_HSYNC: RN21.7 U2.48(HSYNC)
TFP401_HSYNC_FPGA: RN21.2 U8.A18(IO_L65N_SCP2_0)
TFP401_ODCK: R190.1 U2.44(ODCK)
TFP401_ODCK_FPGA: R190.2 U8.B10(IO_L34P_GCLK19_0)
TFP401_VSYNC: RN21.6 U2.47(VSYNC)
TFP401_VSYNC_FPGA: RN21.3 U8.B18(IO_L65P_SCP3_0)
TFP410_CLK: R151.1 U3.57(IDCK+)
TFP410_CLK_FPGA: R151.2 U8.AB12(IO_L31N_GCLK30_D15_2)
TFP410_D0: RN25.8 U3.63(DATA0)
TFP410_D0_FPGA: RN25.1 U8.W10(IO_L44P_2)
TFP410_D1: RN25.7 U3.62(DATA1)
TFP410_D1_FPGA: RN25.2 U8.T11(IO_L40N_2)
TFP410_D2: RN25.6 U3.61(DATA2)
TFP410_D2_FPGA: RN25.3 U8.R11(IO_L40P_2)
TFP410_D3: RN25.5 U3.60(DATA3)
TFP410_D3_FPGA: RN25.4 U8.T12(IO_L22P_2)
TFP410_D4: RN27.8 U3.59(DATA4)
TFP410_D4_FPGA: RN27.1 U8.U12(IO_L22N_2)
TFP410_D5: RN27.7 U3.58(DATA5)
TFP410_D5_FPGA: RN27.2 U8.Y12(IO_L29N_GCLK2_2)
TFP410_D6: RN27.6 U3.55(DATA6)
TFP410_D6_FPGA: RN27.3 U8.V13(IO_L18P_2)
TFP410_D7: RN27.5 U3.54(DATA7)
TFP410_D7_FPGA: RN27.4 U8.T14(IO_L23P_2)
TFP410_D8: RN23.8 U3.53(DATA8)
TFP410_D8_FPGA: RN23.1 U8.W14(IO_L20P_2)
TFP410_D9: RN23.7 U3.52(DATA9)
TFP410_D9_FPGA: RN23.2 U8.AB14(IO_L16N_VREF_2)
TFP410_D10: RN23.6 U3.51(DATA10)
TFP410_D10_FPGA: RN23.3 U8.Y14(IO_L20N_2)
TFP410_D11: RN23.5 U3.50(DATA11)
TFP410_D11_FPGA: RN23.4 U8.W15(IO_L17N_2)
TFP410_D12: RN4.8 U3.47(DATA12)
TFP410_D12_FPGA: RN4.1 U8.AB15(IO_L21N_2)
TFP410_D13: RN4.7 U3.46(DATA13)
TFP410_D13_FPGA: RN4.2 U8.T16(IO_L7P_2)
TFP410_D14: RN4.6 U3.45(DATA14)
TFP410_D14_FPGA: RN4.3 U8.Y16(IO_L17P_2)
TFP410_D15: RN4.5 U3.44(DATA15)
TFP410_D15_FPGA: RN4.4 U8.AB16(IO_L19N_2)
TFP410_D16: RN5.8 U3.43(DATA16)
TFP410_D16_FPGA: RN5.1 U8.AA16(IO_L19P_2)
TFP410_D17: RN5.7 U3.42(DATA17)
TFP410_D17_FPGA: RN5.2 U8.Y17(IO_L15P_2)
TFP410_D18: RN5.6 U3.41(DATA18)
TFP410_D18_FPGA: RN5.3 U8.AB17(IO_L15N_2)
TFP410_D19: RN5.5 U3.40(DATA19)
TFP410_D19_FPGA: RN5.4 U8.V18(IO_L9N_2)
TFP410_D20: RN6.8 U3.39(DATA20)
TFP410_D20_FPGA: RN6.1 U8.W18(IO_L6P_2)
TFP410_D21: RN6.7 U3.38(DATA21)
TFP410_D21_FPGA: RN6.2 U8.AB18(IO_L14N_D12_2)
TFP410_D22: RN6.6 U3.37(DATA22)
TFP410_D22_FPGA: RN6.3 U8.AA18(IO_L14P_D11_2)
TFP410_D23: RN6.5 U3.36(DATA23)
TFP410_D23_FPGA: RN6.4 U8.AB19(IO_L5N_2)
TMS: CN2.5 R19.1
TXD: R159.1
UP_A0: R37.1 U5.N3(A0) U8.H2(IO_L47P_M3A0_3)
UP_A1: R42.1 U5.P7(A1) U8.H1(IO_L47N_M3A1_3)
UP_A2: R41.1 U5.P3(A2) U8.H5(IO_L49N_M3A2_3)
UP_A3: R36.1 U5.N2(A3) U8.K6(IO_L45P_M3A3_3)
UP_A4: R43.1 U5.P8(A4) U8.F3(IO_L51N_M3A4_3)
UP_A5: R40.1 U5.P2(A5) U8.K3(IO_L44P_GCLK21_M3A5_3)
UP_A6: R47.1 U5.R8(A6) U8.J4(IO_L44N_GCLK20_M3A6_3)
UP_A7: R44.1 U5.R2(A7) U8.H6(IO_L49P_M3A7_3)
UP_A8: R50.1 U5.T8(A8) U8.E3(IO_L52P_M3A8_3)
UP_A9: R45.1 U5.R3(A9) U8.E1(IO_L52N_M3A9_3)
UP_A10: R33.1 U5.L7(A10/AP) U8.G4(IO_L51P_M3A10_3)
UP_A11: R46.1 U5.R7(A11) U8.C1(IO_L54N_M3A11_3)
UP_A12: R38.1 U5.N7(A12/BC#) U8.D1(IO_L53N_M3A12_3)
UP_A13: R48.1 U5.T3(A13) U8.G6(IO_L55P_M3A13_3)
UP_A14: R49.1 U5.T7(A14) U8.F5(IO_L55N_M3A14_3)
UP_BA0: R34.1 U5.M2(BA0) U8.G3(IO_L48P_M3BA0_3)
UP_BA1: R39.1 U5.N8(BA1) U8.G1(IO_L48N_M3BA1_3)
UP_BA2: R35.1 U5.M3(BA2) U8.F1(IO_L50N_M3BA2_3)
UP_CAS: R30.1 U5.K3(CAS#) U8.K4(IO_L43N_GCLK22_IRDY2_M3CASN_3)
UP_CK+: R156.1 U5.J7(CK) U8.H4(IO_L46P_M3CLK_3)
UP_CK-: R156.2 U5.K7(CK#) U8.H3(IO_L46N_M3CLKN_3)
UP_CKE: R1.1 U5.K9(CKE) U8.D2(IO_L53P_M3CKE_3)
UP_D0: U5.E3(DQ0) U8.N3(IO_L37P_M3DQ0_3)
UP_D1: U5.F7(DQ1) U8.N1(IO_L37N_M3DQ1_3)
UP_D2: U5.F2(DQ2) U8.M2(IO_L38P_M3DQ2_3)
UP_D3: U5.F8(DQ3) U8.M1(IO_L38N_M3DQ3_3)
UP_D4: U5.H3(DQ4) U8.J3(IO_L41P_GCLK27_M3DQ4_3)
UP_D5: U5.H8(DQ5) U8.J1(IO_L41N_GCLK26_M3DQ5_3)
UP_D6: U5.G2(DQ6) U8.K2(IO_L40P_M3DQ6_3)
UP_D7: U5.H7(DQ7) U8.K1(IO_L40N_M3DQ7_3)
UP_D8: U5.D7(DQ8) U8.P2(IO_L36P_M3DQ8_3)
UP_D9: U5.C3(DQ9) U8.P1(IO_L36N_M3DQ9_3)
UP_D10: U5.C8(DQ10) U8.R3(IO_L35P_M3DQ10_3)
UP_D11: U5.C2(DQ11) U8.R1(IO_L35N_M3DQ11_3)
UP_D12: U5.A7(DQ12) U8.U3(IO_L33P_M3DQ12_3)
UP_D13: U5.A2(DQ13) U8.U1(IO_L33N_M3DQ13_3)
UP_D14: U5.B8(DQ14) U8.V2(IO_L32P_M3DQ14_3)
UP_D15: U5.A3(DQ15) U8.V1(IO_L32N_M3DQ15_3)
UP_LDM: R188.1 U5.E7(LDM)
UP_LDQS+: U5.F3(LDQS) U8.L3(IO_L39P_M3LDQS_3)
UP_LDQS-: U5.G3(LDQS#) U8.L1(IO_L39N_M3LDQSN_3)
UP_ODT: R29.1 U5.K1(ODT) U8.J6(IO_L45N_M3ODT_3)
UP_RAS: R27.1 U5.J3(RAS#) U8.K5(IO_L43P_GCLK23_M3RASN_3)
UP_RST: R2.1 U5.T2(RESET#) U8.C3(IO_L54P_M3RESET_3)
UP_UDM: R189.1 U5.D3(UDM)
UP_UDQS+: U5.C7(UDQS) U8.T2(IO_L34P_M3UDQS_3)
UP_UDQS-: U5.B7(UDQS#) U8.T1(IO_L34N_M3UDQSN_3)
UP_WE: R32.1 U5.L3(WE#) U8.F2(IO_L50P_M3WE_3)
USER_KEY: R150.1 SW3.1 U8.V11(IO_L42P_2)
USER_KEY1: R168.1 SW4.1 U8.U10(IO_L52N_2)
USER_KEY2: R169.1 SW5.1 U8.T15(IO_L7N_2)
USER_LED: Q16.1(G) R149.2 U8.R13(IO_L23N_2)
VGA_5V: C118.2 DSUB1.9 U18.2
VGA_B: C114.2 R84.2 U4.28(IOB) U17.1
VGA_G: C113.2 R85.2 U4.32(IOG) U16.1
VGA_R: C112.2 R86.2 U4.34(IOR) U15.1
VGA_SCL: D6.1 DSUB1.15 Q2.3(D) R91.1
VGA_SDA: D6.6 DSUB1.12 Q1.3(D) R90.2
VGAC_B: C115.2 DSUB1.3 U17.2
VGAC_G: C116.2 DSUB1.2 U16.2
VGAC_R: C117.2 DSUB1.1 U15.2
VSYC: D6.3 DSUB1.14 Q4.3(D) R95.1
NetC3_2: C3.2 R23.1 U8.T6(IO_L65P_INIT_B_2)
NetC4_2: C4.2 R5.1 U8.AA1(PROGRAM_B_2)
NetC110_1: C110.1 U4.35(COMP)
NetC119_1: C119.1 R96.2 R97.2 U7.1(REFIN)
NetC147_2: C147.2 U22.2 X1.1(Tri-state) X1.4(VDD)
NetC148_2: C148.2 U23.2 X2.1(OE) X2.4(VDD)
NetC194_2: C194.2 L22.2 L23.1 R133.2 R135.2 U69.7(FSW) U69.14(VOS)
NetC195_2: C195.2 U69.9(SS/TR)
NetC197_2: C197.2 L24.2 L25.1 R136.2 R138.2 U70.7(FSW) U70.14(VOS)
NetC198_2: C198.2 U70.9(SS/TR)
NetC200_2: C200.2 U71.9(SS/TR)
NetC201_2: C201.2 R140.1
NetC202_1: C202.1 U71.13(BOOT)
NetC202_2: C202.2 L26.1 U71.11(PH) U71.12(PH)
NetC206_2: C206.2 L26.2 L27.1 R142.2 R146.2
NetC216_2: C216.2 L32.2 L33.1
NetD5_1: D5.1(K) U18.1
NetD11_1: D11.1(K) U24.1
NetD17_2: D17.2(A) F1.1
NetD20_1: D20.1(C) DC3.3 F2.2
NetD22_1: D22.1(A) R110.1
NetD22_2: D22.2(A) R111.2
NetD23_1: D23.1(A) R106.1
NetD23_2: D23.2(A) R107.2
NetD24_1: D24.1(A) R90.1
NetD24_2: D24.2(A) R91.2
NetD25_1: D25.1(A) R94.1
NetD25_2: D25.2(A) R95.2
NetL1_1: L1.1 U7.7(EN) U7.10(VIN)
NetL22_1: L22.1 U69.1(SW) U69.2(SW) U69.3(SW)
NetL24_1: L24.1 U70.1(SW) U70.2(SW) U70.3(SW)
NetLED1_1: LED1.1(K) R185.2
NetLED1_3: LED1.3(A) R154.2 U100.4(Y)
NetQ5_3: Q5.3(D) Q6.1(G) U26.1
NetQ9_3: Q9.3(D) Q10.1(G) U31.1
NetQ13_1: Q13.1(G) R133.1 U69.4(PG)
NetQ13_3: Q13.3(D) U78.1(K)
NetQ14_1: Q14.1(G) R136.1 U70.4(PG)
NetQ14_3: Q14.3(D) U79.1(K)
NetQ15_1: Q15.1(G) R146.1 U71.14(PWRGD)
NetQ15_3: Q15.3(D) U80.1(K)
NetQ16_3: Q16.3(D) U81.1(K)
NetR6_2: R6.2 U8.AB20(IO_L3N_MOSI_CSI_B_MISO0_2)
NetR7_2: R7.2 U8.AA20(IO_L3P_D0_DIN_MISO_MISO1_2)
NetR11_2: R11.2 U8.Y21(IO_L1P_CCLK_2)
NetR12_2: R12.2 U8.T5(IO_L65N_CSO_B_2)
NetR13_2: R13.2 U8.U13(IO_L12N_D2_MISO3_2)
NetR14_2: R14.2 U8.U14(IO_L12P_D1_MISO2_2)
NetR26_1: R26.1 U5.L8(ZQ)
NetR53_1: R53.1 U12.L8(ZQ)
NetR78_2: R78.2 R80.2
NetR80_1: R80.1 U4.37(RSET)
NetR98_1: R98.1 U3.19(TFADJ)
NetR102_1: R102.1 R103.2 U3.35(DKEN)
NetR134_2: R134.2 R135.1 U69.5(FB)
NetR137_2: R137.2 R138.1 U70.5(FB)
NetR139_2: R139.2 U71.1(RT/CLK)
NetR140_2: R140.2 U71.8(COMP)
NetR141_2: R141.2 R142.1 U71.7(VSENSE)
NetR143_1: R143.1 U77.2(A)
NetR144_1: R144.1 U78.2(A)
NetR145_1: R145.1 U79.2(A)
NetR147_1: R147.1 U80.2(A)
NetR148_1: R148.1 U81.2(A)
NetR196_2: R196.2 SW3.2
NetR197_2: R197.2 SW4.2
NetR198_2: R198.2 SW5.2
NetU2_8: U2.8(SCDT) U2.9(PDO#)
NetU3_3: U3.3(VREF) U101.1 U102.2

Not connected (* = marked no-connect by the designer): CN2 7* 8*; D12 3*; D16 3*; DSUB1 4* 11*; R78 1; RN13 1* 8*; RN14 3 4 5 6; RN21 1* 8*; RN22 1* 2* 7* 8*; U2 2(PD#)* 7(STAG#)* 49(QO0)* 50(QO1)* 51(QO2)* 52(QO3)* 53(QO4)* 54(QO5)* 55(QO6)* 56(QO7)* 59(QO8)* 60(QO9)* 61(QO10)* 62(QO11)* 63(QO12)* 64(QO13)* 65(QO14)* 66(QO15)* 69(QO16)* 70(QO17)* 71(QO18)* 72(QO19)* 73(QO20)* 74(QO21)* 75(QO22)* 77(QO23)* 96(EXT_RES)*; U3 49(NC)*; U5 J1(NC)* J9(NC)* L1(NC)* L9(NC)* M7(NC)*; U7 9(PGOOD)*; U8 A2(IO_L83P_3)* A4(IO_L1N_VREF_0)* A10(IO_L34N_GCLK18_0) A11(IO_L35N_GCLK16_0) A12(IO_L37N_GCLK12_0) AA14(IO_L16P_2)* AB9(IO_L43N_2)* B1(IO_L60N_3)* B2(IO_L60P_3)* B12(IO_L37P_GCLK13_0) C4(IO_L81N_3)* C10(IO_L33N_0) C11(IO_L35P_GCLK17_0) C12(IO_L36N_GCLK14_0) C13(IO_L38P_0) D3(IO_L81P_3)* D5(IO_L58P_3)* D10(IO_L33P_0) D11(IO_L36P_GCLK15_0) D12(NC)* D13(NC)* D14(IO_L49P_0)* E4(IO_L58N_3)* E5(IO_L82P_3)* E6(IO_L82N_3)* E8(NC)* E10(NC)* E12(NC)* E14(NC)* F7(IO_L80N_3)* F8(NC)* F9(NC)* F10(NC)* F12(NC)* F13(NC)* F14(NC)* F15(NC)* G7(IO_L80P_3)* G8(NC)* G9(NC)* G11(NC)* G13(NC)* G16(IO_L9P_1)* G17(IO_L9N_1)* H8(IO_L59N_3)* H10(NC)* H11(NC)* H12(NC)* H13(NC)* H14(NC)* H16(IO_L28P_1)* J7(IO_L59P_3)* J16(IO_L21N_1)* K7(IO_L57P_3)* K16(IO_L21P_1)* K18(IO_L61N_1)* L4(IO_L42N_GCLK24_M3LDM_3)* L6(IO_L25N_3)* L15(IO_L58N_1)* L17(IO_L61P_1)* L19(IO_L42N_GCLK6_TRDY1_M1LDM_1)* M3(IO_L42P_GCLK25_TRDY2_M3UDM_3)* M5(IO_L31P_3)* M6(IO_L25P_3)* M7(IO_L23P_3)* M8(IO_L23N_3)* M19(IO_L53P_1)* M20(IO_L42P_GCLK7_M1UDM_1)* N4(IO_L26N_3)* N6(IO_L11P_3)* N7(IO_L11N_3)* P3(IO_L26P_3)* P4(IO_L24N_3)* P5(IO_L8N_3)* P6(IO_L8P_3)* P7(IO_L7N_3)* P8(IO_L7P_3)* P15(NC)* P16(NC)* R4(IO_L24P_3)* R16(IO_L10P_2)* R17(NC)* T3(IO_L9N_3)* T4(IO_L9P_3)* T17(IO_L4N_VREF_2)* T18(IO_L4P_2)* U4(IO_L10P_3)* U16(IO_L8N_2)* U17(IO_L8P_2)* V3(IO_L10N_3)* V15(IO_L13N_D10_2)* V19(IO_L9P_2)* W1(IO_L2N_3)* W3(IO_L2P_3) W12(IO_L29P_GCLK3_2)* W13(IO_L18N_2)* W17(IO_L11N_2)* Y2(IO_L1P_3)* Y7(IO_L48P_D7_2)* Y9(IO_L43P_2)* Y13(IO_L30P_GCLK1_D13_2)* Y15(IO_L21P_2)* Y18(IO_L6N_2) Y19(IO_L5P_2)* Y20(CMPCS_B_2)*; U12 J1(NC)* J9(NC)* L1(NC)* L9(NC)* M7(NC)*; U13 3(NC)*; U100 1(NC)*; USB2 13(CEC)* 14(Reserved(N.C.))*; USB3 13(CEC)* 14(Reserved(N.C.))*

## Notes on the sheet
- HDMI/DVI DECODER
- DVI ENCODER
- (near R88) DDC:
  0XA0(W)
  0XA1(R)
- (near F1) NP
- VGA ENCODER
- (near U33) DDC:
  0XA0(W)
  0XA1(R)
- 只是验证学习用，省略共模电感应该问题不大
- (near U19) DDC:
  0XA0(W)
  0XA1(R)
- This termination resistance should be
  as close as possible to the ADV7125 to minimize
  reflections.
- (near U14) NC
- (near U102) NP
- POWER
- BSEL
- EDGE
- 24BIT
- RISING
- 1
- IN
- 12BIT
- FALLING
- 0
- MSEN
- RECEIVER DECT
- OUT
- NO RECEIVER
- ST
- High drive
- Low drive
- ISEL
- DSEL
- DKEN
- I2C EN
- SE CLK
- Control by DK
- I2C DIS
- DS CLK
- Default
- OCK_INV
- DFO
- DSTN support/ODCK held
  low when DE = low
- TFT support/ODCK
  runs continuously
- PD
- (near SW1) NORMAL
- (near SW1) Power down
- PIXS
- 2PIXS/CLK
- 1PIXS/CLK
- (near RN2) NP
- (near U122) NP
- DDR3:4Gb*2
- FMC_LPC
- 1.5V BANK1
- 1.5V BANK3
- 3.3V BANK2
- Spartan 6 FPGA
- (near U8) If VCCO_2 is 2.5V or 3.3V,
  VCCAUX can be either 2.5V or 3.3V.
- (near RN23) 此电容是为了延迟FPGA配置开始时间，
  等待FLASH准备好
- The active-Low Chip Select (CS#) pin of the target memory device
  should be connected to ground on the board.
  Because the MCB only supports connections to a single memory component,
  it does not provide a signal to control the CS# input.
- For DDR3 memory devices, the RESET and CKE signals should each have a 4.7 kΩ
  resistor to ground to ensure that these signals are Low during memory initialization.
- (near U8) 3.3V BANK0
- 放置端接在NAND FLASH
- (near C4) 此电容是为了延迟FPGA配置开始时间，
  等待FLASH准备好
- JTAG_PINS have internal pull-up res
- 上绿下红
- 更新日期
- 2024-05-24
- 原理图
- 图页
- Schematic1
- P1
- 创建日期
- 物料编码
- 2024-04-18
- 审阅
- 绘制
- VIDEO_CONVERTER
- 版本
- V1.0
- 尺寸
- A4
- 页
- EE_LAB
- 共
- 3